# Altium schematic sheet 0112_AUDIO - AMP ALC131.SchDoc
size 848 x 558 mm
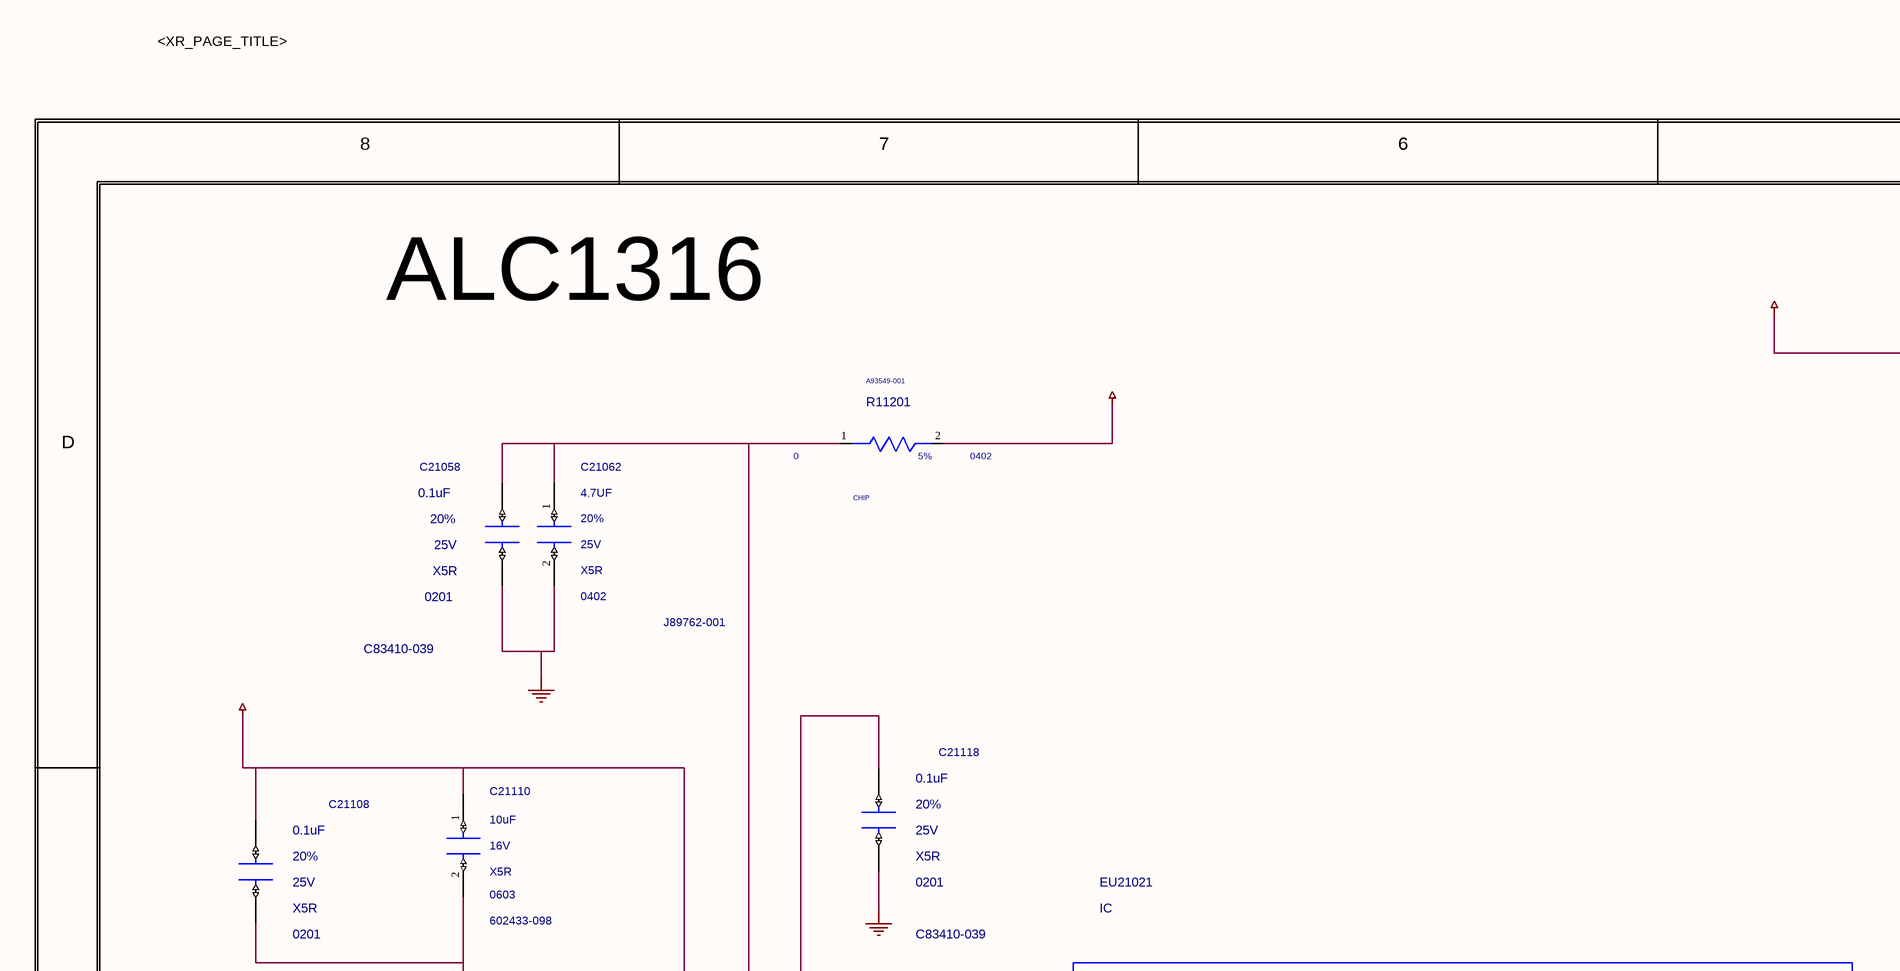
[diagram p0: 0112_AUDIO - AMP ALC131.SchDoc, top left]
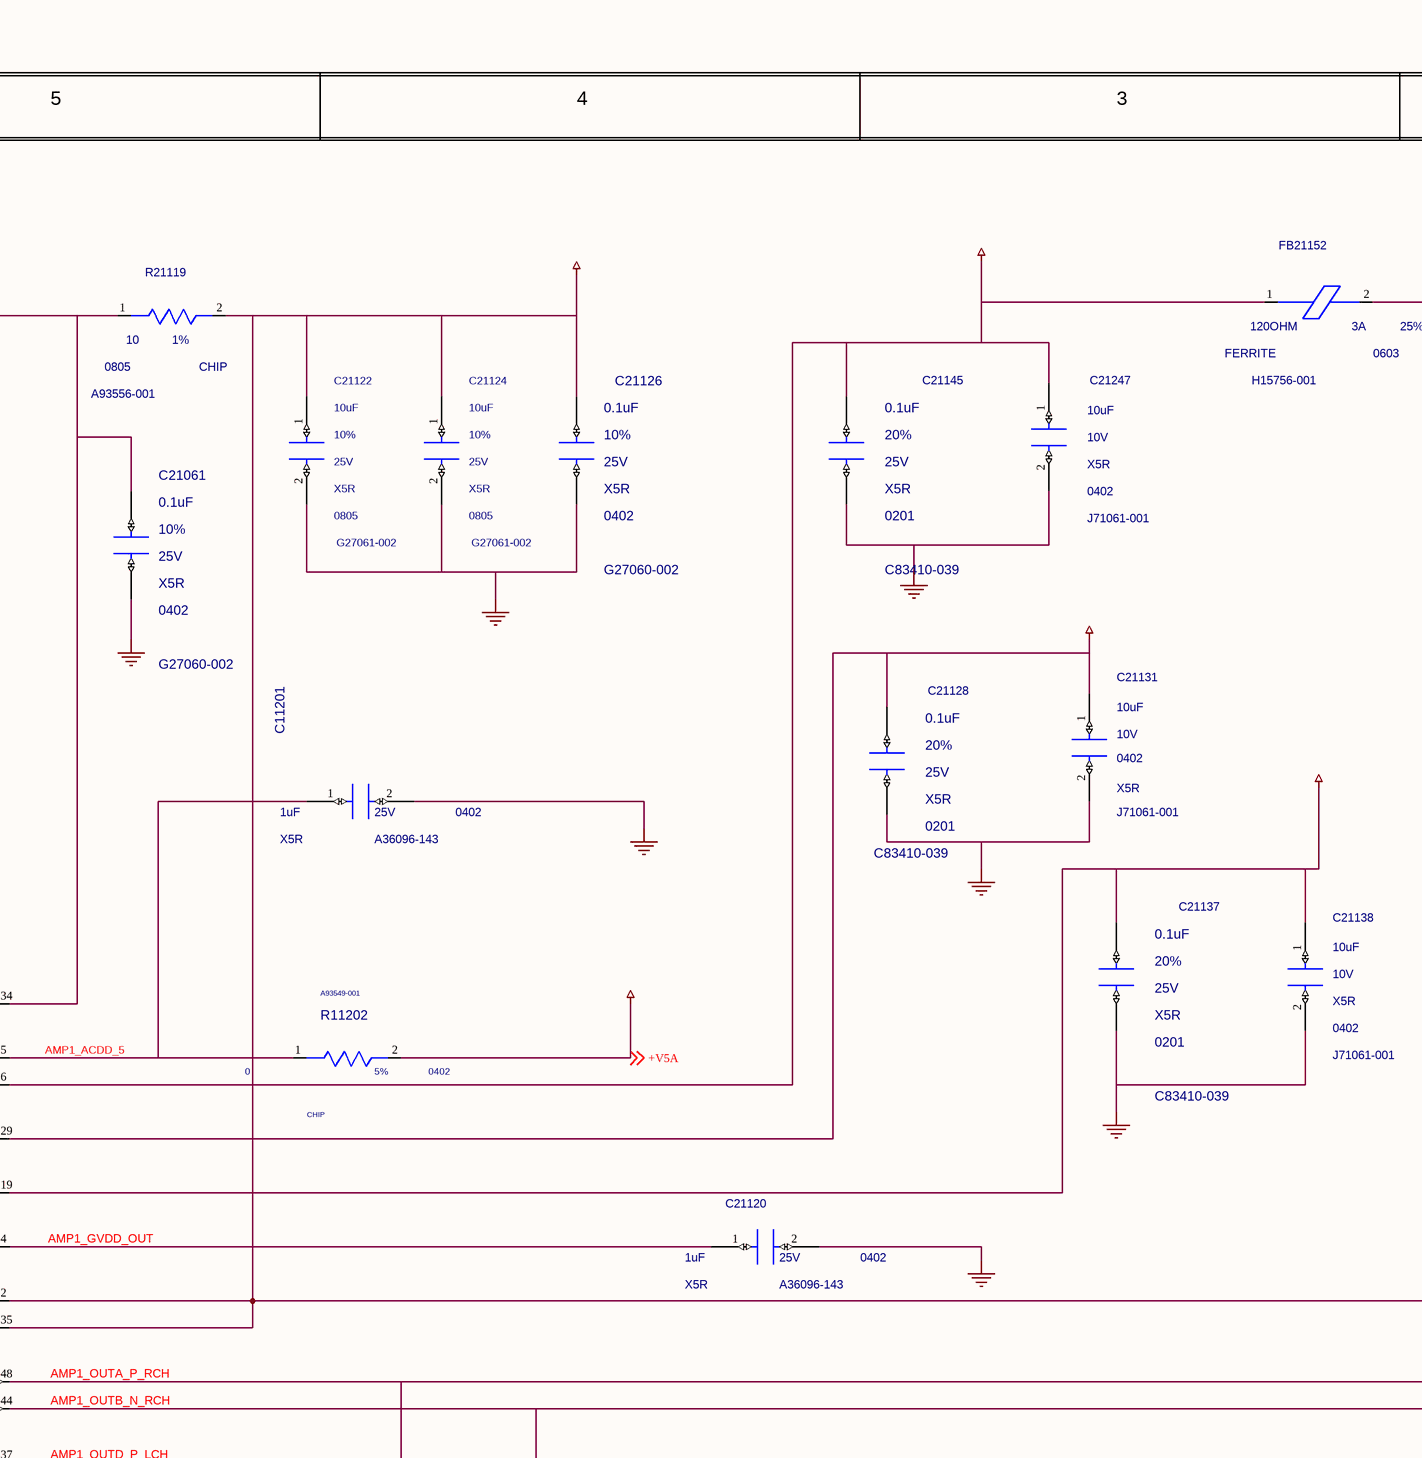
[diagram p1: 0112_AUDIO - AMP ALC131.SchDoc, top middle]
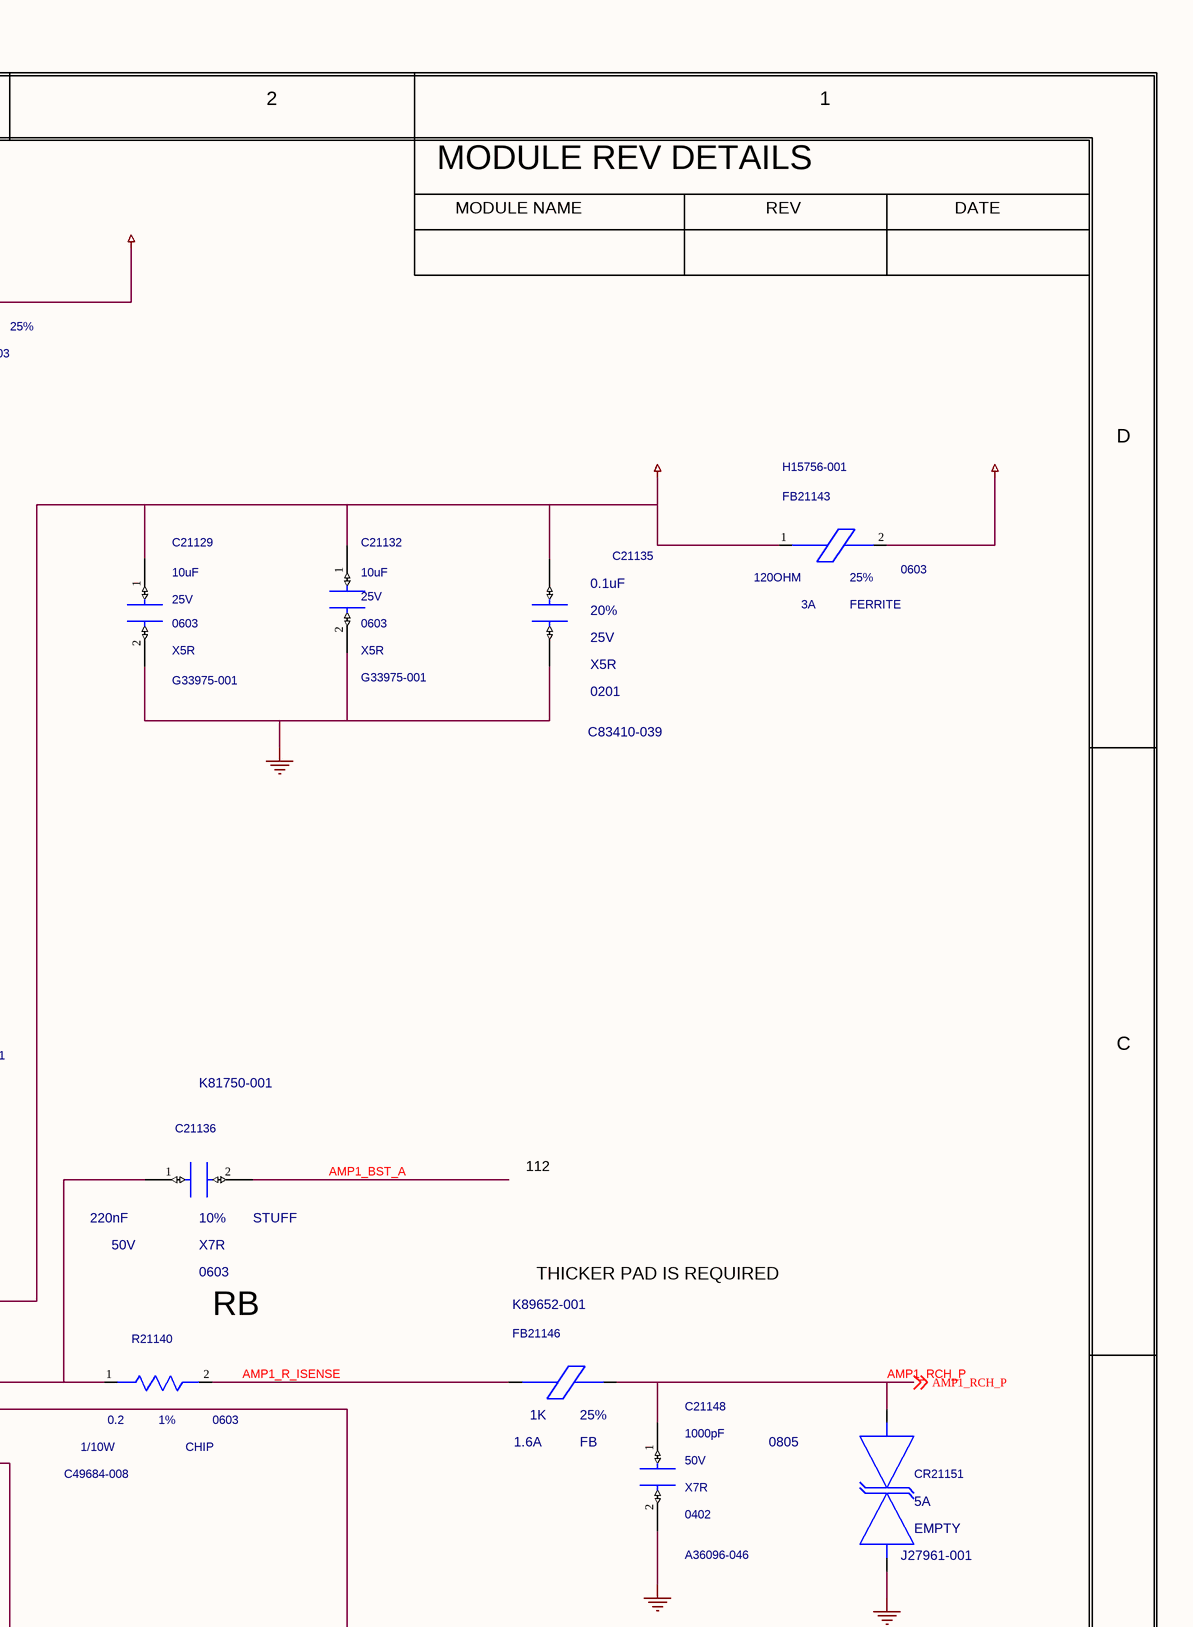
[diagram p2: 0112_AUDIO - AMP ALC131.SchDoc, top right]
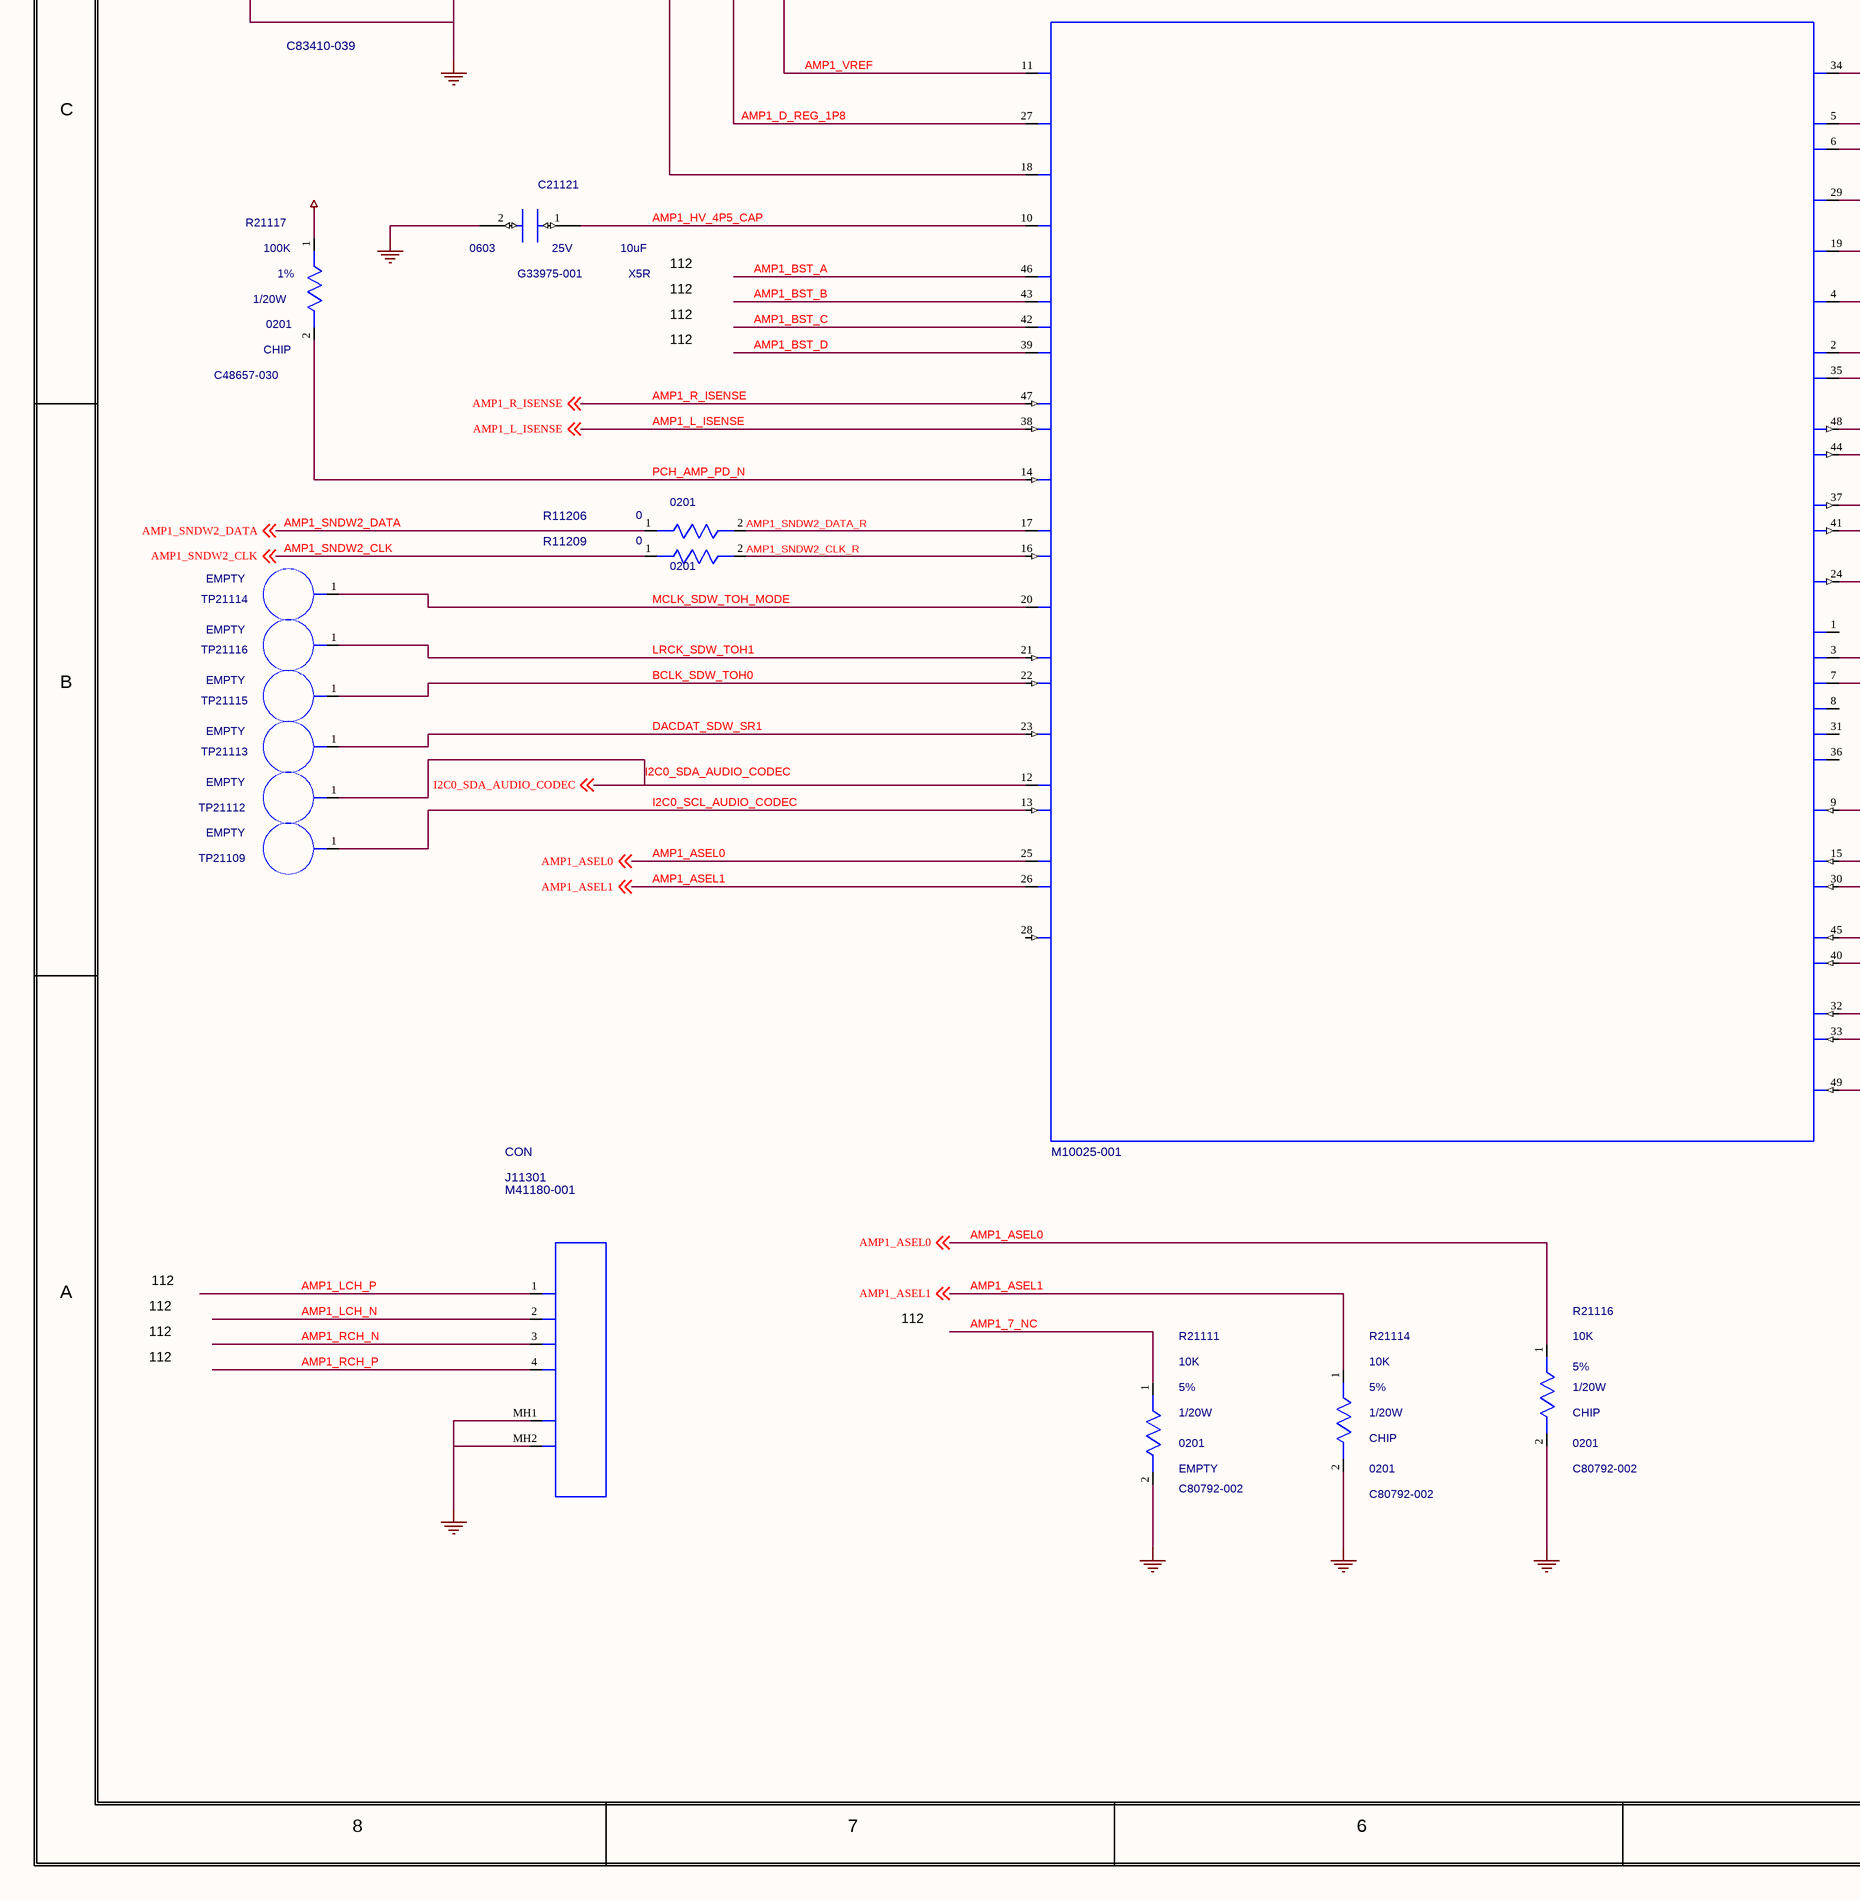
[diagram p3: 0112_AUDIO - AMP ALC131.SchDoc, bottom left]
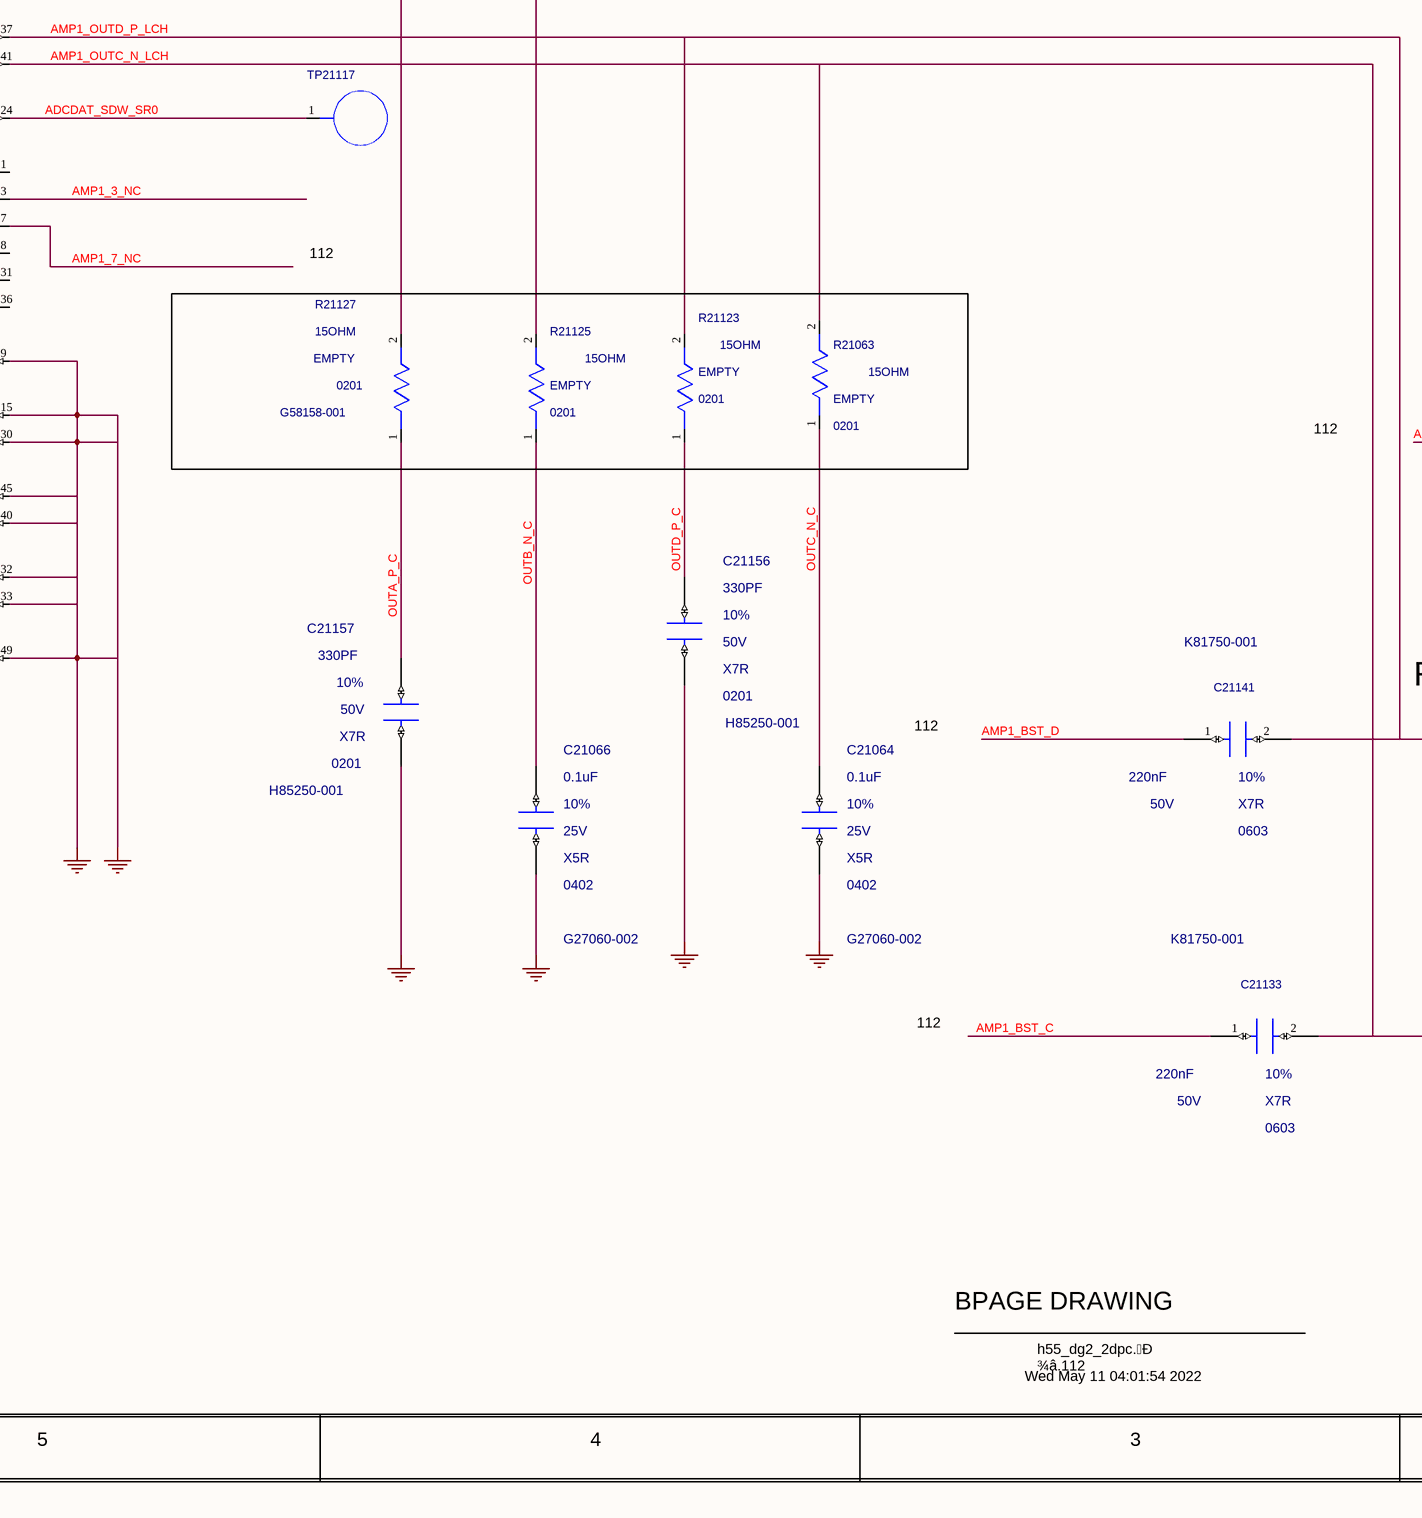
[diagram p4: 0112_AUDIO - AMP ALC131.SchDoc, bottom middle]
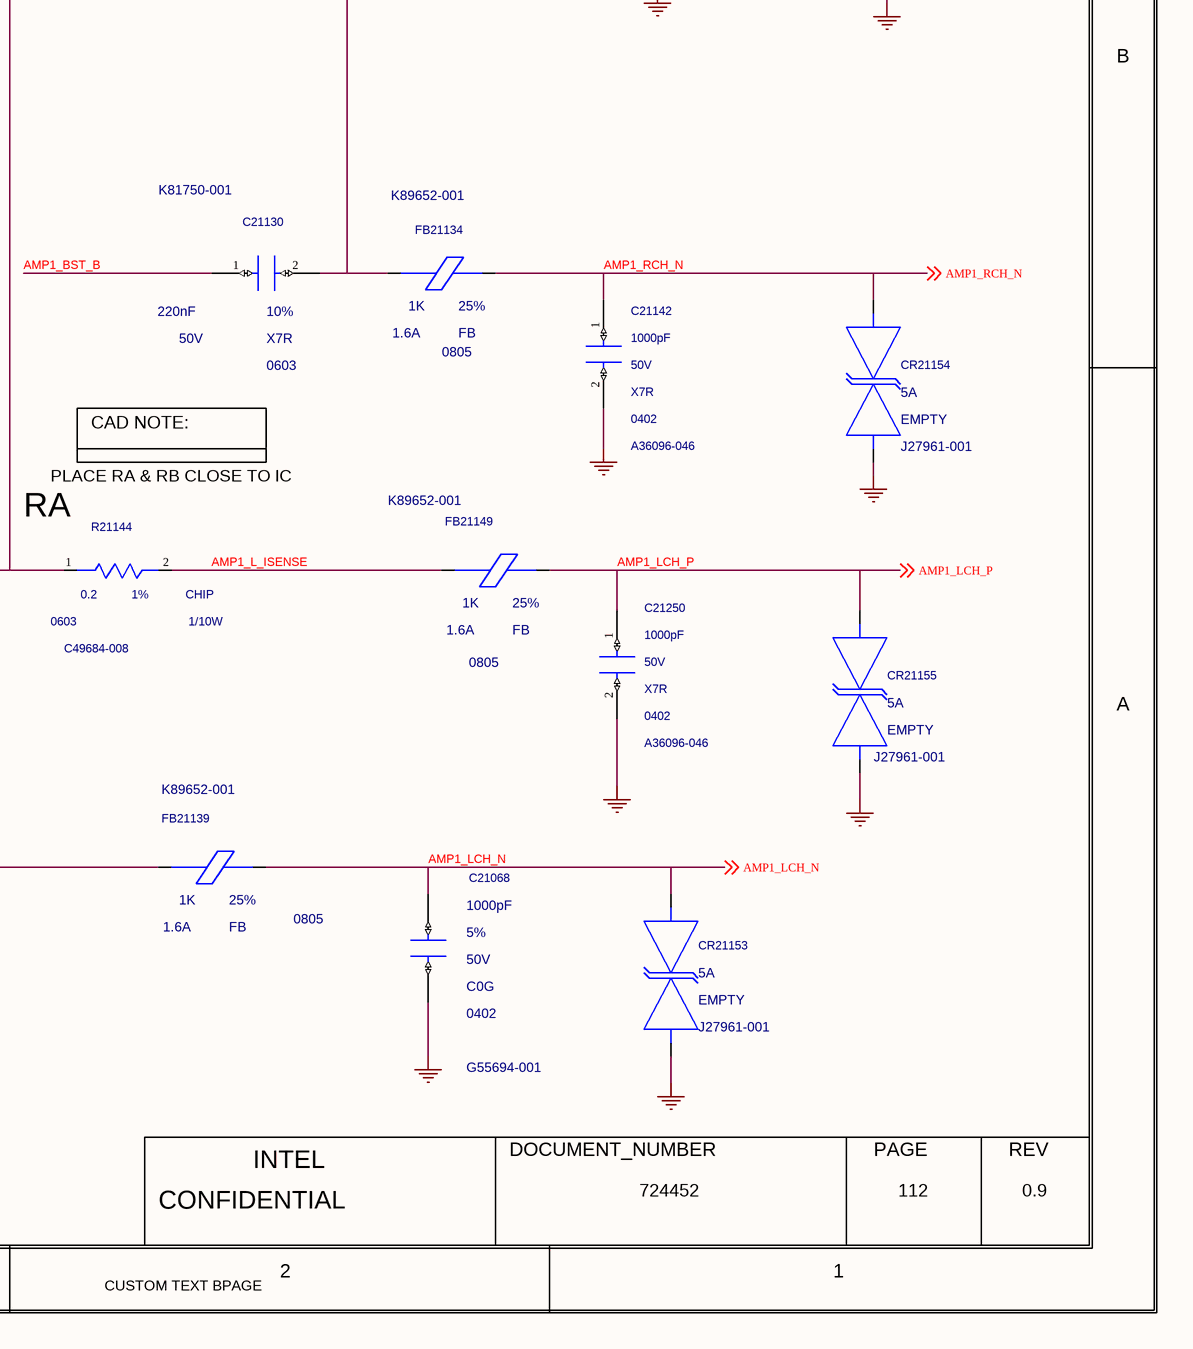
[diagram p5: 0112_AUDIO - AMP ALC131.SchDoc, bottom right]

## Parts
C11201  1uF  MATERIAL: X5R  PACK_TYPE: 0402  PART_NUMBER: A36096-143  VOLTAGE: 25V  [SMC0402MA]
C21058  0.1uF  MATERIAL: X5R  PACK_TYPE: 0201  PART_NUMBER: C83410-039  TOLERANCE: 20%  VOLTAGE: 25V  [TK0_SM0201_630X330_ME]
C21061  0.1uF  MATERIAL: X5R  PACK_TYPE: 0402  PART_NUMBER: G27060-002  TOLERANCE: 10%  VOLTAGE: 25V  [CTK2_SM0402_1050X550_MA]
C21062  4.7UF  MATERIAL: X5R  PACK_TYPE: 0402  PART_NUMBER: J89762-001  TOLERANCE: 20%  VOLTAGE: 25V  [SMC0402MC]
C21064  0.1uF  MATERIAL: X5R  PACK_TYPE: 0402  PART_NUMBER: G27060-002  TOLERANCE: 10%  VOLTAGE: 25V  [CTK2_SM0402_1050X550_MA]
C21066  0.1uF  MATERIAL: X5R  PACK_TYPE: 0402  PART_NUMBER: G27060-002  TOLERANCE: 10%  VOLTAGE: 25V  [CTK2_SM0402_1050X550_MA]
C21068  1000pF  MATERIAL: C0G  PACK_TYPE: 0402  PART_NUMBER: G55694-001  TOLERANCE: 5%  VOLTAGE: 50V  [TK0_SM0402_1050X550_MB]
C21108  0.1uF  MATERIAL: X5R  PACK_TYPE: 0201  PART_NUMBER: C83410-039  TOLERANCE: 20%  VOLTAGE: 25V  [TK0_SM0201_630X330_ME]
C21110  10uF  MATERIAL: X5R  PACK_TYPE: 0603  PART_NUMBER: 602433-098  VOLTAGE: 16V  [SMC0603IA]
C21118  0.1uF  MATERIAL: X5R  PACK_TYPE: 0201  PART_NUMBER: C83410-039  TOLERANCE: 20%  VOLTAGE: 25V  [TK0_SM0201_630X330_ME]
C21120  1uF  MATERIAL: X5R  PACK_TYPE: 0402  PART_NUMBER: A36096-143  VOLTAGE: 25V  [SMC0402MA]
C21121  10uF  MATERIAL: X5R  PACK_TYPE: 0603  PART_NUMBER: G33975-001  VOLTAGE: 25V  [SMC0603IA]
C21122  10uF  MATERIAL: X5R  PACK_TYPE: 0805  PART_NUMBER: G27061-002  TOLERANCE: 10%  VOLTAGE: 25V  [SMC0805MA]
C21124  10uF  MATERIAL: X5R  PACK_TYPE: 0805  PART_NUMBER: G27061-002  TOLERANCE: 10%  VOLTAGE: 25V  [SMC0805MA]
C21126  0.1uF  MATERIAL: X5R  PACK_TYPE: 0402  PART_NUMBER: G27060-002  TOLERANCE: 10%  VOLTAGE: 25V  [CTK2_SM0402_1050X550_MA]
C21128  0.1uF  MATERIAL: X5R  PACK_TYPE: 0201  PART_NUMBER: C83410-039  TOLERANCE: 20%  VOLTAGE: 25V  [TK0_SM0201_630X330_ME]
C21129  10uF  MATERIAL: X5R  PACK_TYPE: 0603  PART_NUMBER: G33975-001  VOLTAGE: 25V  [SMC0603IA]
C21130  220nF  MATERIAL: X7R  PACK_TYPE: 0603  PART_NUMBER: K81750-001  TOLERANCE: 10%  VOLTAGE: 50V  [TK0_SM0603_1800X950_MF]
C21131  10uF  MATERIAL: X5R  PACK_TYPE: 0402  PART_NUMBER: J71061-001  VOLTAGE: 10V  [SMC0402ID]
C21132  10uF  MATERIAL: X5R  PACK_TYPE: 0603  PART_NUMBER: G33975-001  VOLTAGE: 25V  [SMC0603IA]
C21133  220nF  MATERIAL: X7R  PACK_TYPE: 0603  PART_NUMBER: K81750-001  TOLERANCE: 10%  VOLTAGE: 50V  [TK0_SM0603_1800X950_MF]
C21135  0.1uF  MATERIAL: X5R  PACK_TYPE: 0201  PART_NUMBER: C83410-039  TOLERANCE: 20%  VOLTAGE: 25V  [TK0_SM0201_630X330_ME]
C21136  220nF  BOM_USE: STUFF  MATERIAL: X7R  PACK_TYPE: 0603  PART_NUMBER: K81750-001  TOLERANCE: 10%  VOLTAGE: 50V  [TK0_SM0603_1800X950_MF]
C21137  0.1uF  MATERIAL: X5R  PACK_TYPE: 0201  PART_NUMBER: C83410-039  TOLERANCE: 20%  VOLTAGE: 25V  [TK0_SM0201_630X330_ME]
C21138  10uF  MATERIAL: X5R  PACK_TYPE: 0402  PART_NUMBER: J71061-001  VOLTAGE: 10V  [SMC0402ID]
C21141  220nF  MATERIAL: X7R  PACK_TYPE: 0603  PART_NUMBER: K81750-001  TOLERANCE: 10%  VOLTAGE: 50V  [TK0_SM0603_1800X950_MF]
C21142  1000pF  MATERIAL: X7R  PACK_TYPE: 0402  PART_NUMBER: A36096-046  VOLTAGE: 50V  [SMC0402IA]
C21145  0.1uF  MATERIAL: X5R  PACK_TYPE: 0201  PART_NUMBER: C83410-039  TOLERANCE: 20%  VOLTAGE: 25V  [TK0_SM0201_630X330_ME]
C21148  1000pF  MATERIAL: X7R  PACK_TYPE: 0402  PART_NUMBER: A36096-046  VOLTAGE: 50V  [SMC0402IA]
C21156  330PF  MATERIAL: X7R  PACK_TYPE: 0201  PART_NUMBER: H85250-001  TOLERANCE: 10%  VOLTAGE: 50V  [CTK0_SM0201_630X330_MA]
C21157  330PF  MATERIAL: X7R  PACK_TYPE: 0201  PART_NUMBER: H85250-001  TOLERANCE: 10%  VOLTAGE: 50V  [CTK0_SM0201_630X330_MA]
C21247  10uF  MATERIAL: X5R  PACK_TYPE: 0402  PART_NUMBER: J71061-001  VOLTAGE: 10V  [SMC0402ID]
C21250  1000pF  MATERIAL: X7R  PACK_TYPE: 0402  PART_NUMBER: A36096-046  VOLTAGE: 50V  [SMC0402IA]
CR21151  CURRENT: 5A  MATERIAL: EMPTY  PART_NUMBER: J27961-001  [CTK2_SCR0201_670X370_MB]  (hidden comment: ESD203-B1-02ELS)
CR21153  CURRENT: 5A  MATERIAL: EMPTY  PART_NUMBER: J27961-001  [CTK2_SCR0201_670X370_MB]  (hidden comment: ESD203-B1-02ELS)
CR21154  CURRENT: 5A  MATERIAL: EMPTY  PART_NUMBER: J27961-001  [CTK2_SCR0201_670X370_MB]  (hidden comment: ESD203-B1-02ELS)
CR21155  CURRENT: 5A  MATERIAL: EMPTY  PART_NUMBER: J27961-001  [CTK2_SCR0201_670X370_MB]  (hidden comment: ESD203-B1-02ELS)
EU21021  MATERIAL: IC  PART_NUMBER: M10025-001  [CTK1_LCC48_S6100_400_DFS4400_MB]  (hidden comment: C_ALC1316)
FB21134  1K  CURRENT: 1.6A  MATERIAL: FB  PACK_TYPE: 0805  PART_NUMBER: K89652-001  TOLERANCE: 25%  [TK2_SM0805_2200X1450_MA]
FB21139  1K  CURRENT: 1.6A  MATERIAL: FB  PACK_TYPE: 0805  PART_NUMBER: K89652-001  TOLERANCE: 25%  [TK2_SM0805_2200X1450_MA]
FB21143  120OHM  CURRENT: 3A  PACK_TYPE: 0603  PART_NUMBER: H15756-001  TOLERANCE: 25%  [SFB0603IB]
FB21146  1K  CURRENT: 1.6A  MATERIAL: FB  PACK_TYPE: 0805  PART_NUMBER: K89652-001  TOLERANCE: 25%  [TK2_SM0805_2200X1450_MA]
FB21149  1K  CURRENT: 1.6A  MATERIAL: FB  PACK_TYPE: 0805  PART_NUMBER: K89652-001  TOLERANCE: 25%  [TK2_SM0805_2200X1450_MA]
FB21152  120OHM  CURRENT: 3A  PACK_TYPE: 0603  PART_NUMBER: H15756-001  TOLERANCE: 25%  [SFB0603IB]
J11301  MATERIAL: CON  PART_NUMBER: M41180-001  [CTK0_B2B_SPR_1X4_2EM_1000_MA_VR_KOZ]  (hidden comment: C_B2B_1X4_2EM)
R11201  0  MATERIAL: CHIP  PACK_TYPE: 0402  PART_NUMBER: A93549-001  TOLERANCE: 5%  [SMR0402IA]
R11202  0  MATERIAL: CHIP  PACK_TYPE: 0402  PART_NUMBER: A93549-001  TOLERANCE: 5%  [SMR0402IA]
R11206  0  PACK_TYPE: 0201  [SMR0201IA]
R11209  0  PACK_TYPE: 0201  [SMR0201IA]
R21063  15OHM  MATERIAL: EMPTY  PACK_TYPE: 0201  [SMR0201IA]
R21111  10K  MATERIAL: EMPTY  PACK_TYPE: 0201  PART_NUMBER: C80792-002  TOLERANCE: 5%  WATTAGE: 1/20W  [SMR0201IA]
R21114  10K  MATERIAL: CHIP  PACK_TYPE: 0201  PART_NUMBER: C80792-002  TOLERANCE: 5%  WATTAGE: 1/20W  [SMR0201IA]
R21116  10K  MATERIAL: CHIP  PACK_TYPE: 0201  PART_NUMBER: C80792-002  TOLERANCE: 5%  WATTAGE: 1/20W  [SMR0201IA]
R21117  100K  MATERIAL: CHIP  PACK_TYPE: 0201  PART_NUMBER: C48657-030  TOLERANCE: 1%  WATTAGE: 1/20W  [SMR0201MC]
R21119  10  MATERIAL: CHIP  PACK_TYPE: 0805  PART_NUMBER: A93556-001  TOLERANCE: 1%  [SMR0805IA]
R21123  15OHM  MATERIAL: EMPTY  PACK_TYPE: 0201  [SMR0201IA]
R21125  15OHM  MATERIAL: EMPTY  PACK_TYPE: 0201  [SMR0201IA]
R21127  15OHM  MATERIAL: EMPTY  PACK_TYPE: 0201  PART_NUMBER: G58158-001  [SMR0201IA]
R21140  0.2  MATERIAL: CHIP  PACK_TYPE: 0603  PART_NUMBER: C49684-008  TOLERANCE: 1%  WATTAGE: 1/10W  [SMR0603A]
R21144  0.2  MATERIAL: CHIP  PACK_TYPE: 0603  PART_NUMBER: C49684-008  TOLERANCE: 1%  WATTAGE: 1/10W  [SMR0603A]
TP21109  MATERIAL: EMPTY  [TPS16]  (hidden comment: TP)
TP21112  MATERIAL: EMPTY  [TPS16]  (hidden comment: TP)
TP21113  MATERIAL: EMPTY  [TPS16]  (hidden comment: TP)
TP21114  MATERIAL: EMPTY  [TPS16]  (hidden comment: TP)
TP21115  MATERIAL: EMPTY  [TPS16]  (hidden comment: TP)
TP21116  MATERIAL: EMPTY  [TPS16]  (hidden comment: TP)
TP21117  TP  [TPS16]  (value not drawn)

## Nets
+V1P8A_AUDIO: C21108.1(A) C21110.1(A) C21137.1(A) C21138.1(A) EU21021.18(SDW_IO_18) EU21021.19(DVDD_IO) R11201.2(B) R21117.1(A)
+V3P3DX_AUDIO: C21128.1(A) C21131.1(A) EU21021.29(DVDD_33) FB21152.2(B)
+V3P3DX_AUDIO_AMP1: C21145.1(A) C21247.1(A) EU21021.6(AVDD_33) FB21152.1(A)
+V5A: R11202.2(B) ; off-sheet +V5A
+VBATA_AMP1_AVCC: C21061.1(A) EU21021.34(AVCC) R21119.1(A)
+VBATA_AMP1_PVDD: C21122.1(A) C21124.1(A) C21126.1(A) C21129.1(A) C21132.1(A) C21135.1(A) EU21021.2(PVDD_AB) EU21021.35(PVDD_CD) FB21143.1(A) R21119.2(B)
+VBATA_SPK: FB21143.2(B)
GND: C11201.2(B) C21058.2(B) C21061.2(B) C21062.2(B) C21064.2(B) C21066.2(B) C21068.2(B) C21108.2(B) C21110.2(B) C21118.2(B) C21120.2(B) C21121.2(B) C21122.2(B) C21124.2(B) C21126.2(B) C21128.2(B) C21129.2(B) C21131.2(B) C21132.2(B) C21135.2(B) C21137.2(B) C21138.2(B) C21142.2(B) C21145.2(B) C21148.2(B) C21156.2(B) C21157.2(B) C21247.2(B) C21250.2(B) CR21151.2(A2) CR21153.2(A2) CR21154.2(A2) CR21155.2(A2) EU21021.9(AGND) EU21021.15(DGND) EU21021.30(DGND_LV) EU21021.32(VSS_SUB) EU21021.33(VSS_ANA) EU21021.40(PGND_CD) EU21021.45(PGND_AB) EU21021.49(GND_TPD) J11301.MH1 J11301.MH2 R21111.2(B) R21114.2(B) R21116.2(B)
ADCDAT_SDW_SR0: EU21021.24(ADCDAT_SDW_SR0) TP21117.1(TP)
AMP1_3_NC: EU21021.3(NC_2)
AMP1_7_NC: EU21021.7(NC_3) R21111.1(A)
AMP1_ACDD_5: C11201.1(A) EU21021.5(AVDD_5) R11202.1(A)
AMP1_ASEL0: EU21021.25(ASEL0_VI_DAT_SYNC) R21116.1(A) ; off-sheet AMP1_ASEL0
AMP1_ASEL1: EU21021.26(ASEL1) R21114.1(A) ; off-sheet AMP1_ASEL1
AMP1_BST_A: C21136.2(B) EU21021.46(BST_A)
AMP1_BST_B: C21130.1(A) EU21021.43(BST_B)
AMP1_BST_C: C21133.1(A) EU21021.42(BST_C)
AMP1_BST_D: C21141.1(A) EU21021.39(BST_D)
AMP1_D_REG_1P8: C21058.1(A) C21062.1(A) EU21021.27(D_REG_18) R11201.1(A)
AMP1_GVDD_OUT: C21120.1(A) EU21021.4(GVDD_OUT)
AMP1_HV_4P5_CAP: C21121.1(A) EU21021.10(HV_45_CAP)
AMP1_L_ISENSE: EU21021.38(L_ISENSE) FB21149.1(A) R21144.2(B) ; off-sheet AMP1_L_ISENSE
AMP1_LCH_N: C21068.1(A) CR21153.1(A1) FB21139.2(B) J11301.2(IO2) ; off-sheet AMP1_LCH_N
AMP1_LCH_P: C21250.1(A) CR21155.1(A1) FB21149.2(B) J11301.1(IO1) ; off-sheet AMP1_LCH_P
AMP1_OUTA_P_RCH: C21136.1(A) EU21021.48(OUTA_P_RCH) R21127.2(B) R21140.1(A)
AMP1_OUTB_N_RCH: C21130.2(B) EU21021.44(OUTB_N_RCH) FB21134.1(A) R21125.2(B)
AMP1_OUTC_N_LCH: C21133.2(B) EU21021.41(OUTC_N_LCH) FB21139.1(A) R21063.2(B)
AMP1_OUTD_P_LCH: C21141.2(B) EU21021.37(OUTD_P_LCH) R21123.2(B) R21144.1(A)
AMP1_R_ISENSE: EU21021.47(R_ISENSE) FB21146.1(A) R21140.2(B) ; off-sheet AMP1_R_ISENSE
AMP1_RCH_N: C21142.1(A) CR21154.1(A1) FB21134.2(B) J11301.3(IO3) ; off-sheet AMP1_RCH_N
AMP1_RCH_P: C21148.1(A) CR21151.1(A1) FB21146.2(B) J11301.4(IO4) ; off-sheet AMP1_RCH_P
AMP1_SNDW2_CLK: R11209.1(A) ; off-sheet AMP1_SNDW2_CLK
AMP1_SNDW2_CLK_R: EU21021.16(SDW_CLK) R11209.2(B)
AMP1_SNDW2_DATA: R11206.1(A) ; off-sheet AMP1_SNDW2_DATA
AMP1_SNDW2_DATA_R: EU21021.17(SDW_DAT) R11206.2(B)
AMP1_VREF: C21118.1(A) EU21021.11(VREF)
BCLK_SDW_TOH0: EU21021.22(BCLK_SDW_TOH0) TP21115.1(TP)
DACDAT_SDW_SR1: EU21021.23(DACDAT_SDW_SR1) TP21113.1(TP)
I2C0_SCL_AUDIO_CODEC: EU21021.13(SCL) TP21109.1(TP)
I2C0_SDA_AUDIO_CODEC: EU21021.12(SDA) TP21112.1(TP) ; off-sheet I2C0_SDA_AUDIO_CODEC
LRCK_SDW_TOH1: EU21021.21(LRCK_SDW_TOH1) TP21116.1(TP)
MCLK_SDW_TOH_MODE: EU21021.20(MCLK_SDW_TOH_MODE_VI_DAT_SYNC) TP21114.1(TP)
OUTA_P_C: C21157.1(A) R21127.1(A)
OUTB_N_C: C21066.1(A) R21125.1(A)
OUTC_N_C: C21064.1(A) R21063.1(A)
OUTD_P_C: C21156.1(A) R21123.1(A)
PCH_AMP_PD_N: EU21021.14(PDB) R21117.2(B)

Not connected (* = marked no-connect by the designer): EU21021 1(NC_1) 8(NC_4) 28(MULTI_SPK) 31(NC_5) 36(NC_6)

## Notes on the sheet
- <XR_PAGE_TITLE>
- 8
- 7
- 6
- 5
- 4
- 3
- 2
- 1
- MODULE REV DETAILS
- MODULE NAME
- REV
- DATE
- ALC1316
- D
- C
- 112
- THICKER PAD IS REQUIRED
- RB
- B
- CAD NOTE:
- PLACE RA & RB CLOSE TO IC
- (near R21144) RA
- A
- BPAGE DRAWING
- h55_dg2_2dpc.Ð
  ¾â.112
- INTEL
- DOCUMENT_NUMBER
- PAGE
- Wed May 11 04:01:54 2022
- CONFIDENTIAL
- 724452
- 0.9
- CUSTOM TEXT BPAGE

## Library data of the parts
C11201 = CAP: CDS_PHYS_PART_NAME: CAP_0402-A36096-143,X5R,1UF,25V,10%,LPDB,GENERIC; TOLERANCE: 10%; OriginalSymbolOrigin: (-50,25); XY: (4850,3725); VER: 1; PHYS_PAGE: 112; LOCATION: C11201; FP_TECH: LPDB; DRAWING: @RVP1_ADL_SB_ADP_S_DDR5_SODIMM_2DPC_LIB.H55_DG2_2DPC(SCH_1):PAGE483; CDS_LIB: discrete; PCB Footprint: SMC0402MA; ROT: 1; CHIPS_PART_NAME: CAP; CDS_PART_NAME: CAP_0402-A36096-143,X5R,1UF,25V,10%,LPDB,GENERIC; CDS_LOCATION: C11201
C21058 = CAP_2: CDS_PHYS_PART_NAME: CAP_2_0201-C83410-039,X5R,0.1UF,25V,20%,TK0,GENERIC; BOM_USE: STUFF; CDS_LMAN_SYM_OUTLINE: -50,50,50,-50; FP_TECH: TK0; IP: GENERIC; ROOM: NONE; OriginalSymbolOrigin: (-50,25); XY: (1550,4275); VER: 1; ROT: 2; PHYS_PAGE: 112; LOCATION: C21058; DRAWING: @RVP1_ADL_SB_ADP_S_DDR5_SODIMM_2DPC_LIB.H55_DG2_2DPC(SCH_1):PAGE483; CDS_LIB: discrete_2; VARIANT: ?; PCB Footprint: TK0_SM0201_630X330_ME; CHIPS_PART_NAME: CAP_2; CDS_PART_NAME: CAP_2_0201-C83410-039,X5R,0.1UF,25V,20%,TK0,GENERIC; CDS_LOCATION: C21058
C21061 = C_CAP: CDS_PHYS_PART_NAME: C_CAP_0402-G27060-002,X5R,0.1UF,25V,10%,TK2,GENERIC; CDS_LMAN_SYM_OUTLINE: -50,50,50,-50; FP_TECH: TK2; IP: GENERIC; ROOM: NONE; OriginalSymbolOrigin: (-50,25); XY: (4425,4200); VER: 1; ROT: 0; PHYS_PAGE: 112; LOCATION: C21061; DRAWING: @RVP1_ADL_SB_ADP_S_DDR5_SODIMM_2DPC_LIB.H55_DG2_2DPC(SCH_1):PAGE483; CDS_LIB: c_discrete; VARIANT: ?; PCB Footprint: CTK2_SM0402_1050X550_MA; CHIPS_PART_NAME: C_CAP; CDS_PART_NAME: C_CAP_0402-G27060-002,X5R,0.1UF,25V,10%,TK2,GENERIC; CDS_LOCATION: C21061
C21062 = CAP: CDS_PHYS_PART_NAME: CAP_0402-J89762-001,X5R,4.7UF,25V,20%,LPDB,GENERIC; OriginalSymbolOrigin: (-50,25); XY: (1650,4275); VER: 1; ROT: 2; ROOM: AUDIO; PHYS_PAGE: 112; LOCATION: C21062; IP: GENERIC; FP_TECH: LPDB; DRAWING: @RVP1_ADL_SB_ADP_S_DDR5_SODIMM_2DPC_LIB.H55_DG2_2DPC(SCH_1):PAGE483; CDS_LMAN_SYM_OUTLINE: -50,50,50,-50; CDS_LIB: discrete; BOM_USE: STUFF; PCB Footprint: SMC0402MC; CHIPS_PART_NAME: CAP; CDS_PART_NAME: CAP_0402-J89762-001,X5R,4.7UF,25V,20%,LPDB,GENERIC; CDS_LOCATION: C21062
C21064 = C_CAP: CDS_PHYS_PART_NAME: C_CAP_0402-G27060-002,X5R,0.1UF,25V,10%,TK2,GENERIC; CDS_LMAN_SYM_OUTLINE: -50,50,50,-50; FP_TECH: TK2; IP: GENERIC; ROOM: NONE; OriginalSymbolOrigin: (-50,25); XY: (5700,1050); VER: 1; ROT: 0; PHYS_PAGE: 112; LOCATION: C21064; DRAWING: @RVP1_ADL_SB_ADP_S_DDR5_SODIMM_2DPC_LIB.H55_DG2_2DPC(SCH_1):PAGE483; CDS_LIB: c_discrete; VARIANT: ?; PCB Footprint: CTK2_SM0402_1050X550_MA; CHIPS_PART_NAME: C_CAP; CDS_PART_NAME: C_CAP_0402-G27060-002,X5R,0.1UF,25V,10%,TK2,GENERIC; CDS_LOCATION: C21064
C21066 = C_CAP: CDS_PHYS_PART_NAME: C_CAP_0402-G27060-002,X5R,0.1UF,25V,10%,TK2,GENERIC; CDS_LMAN_SYM_OUTLINE: -50,50,50,-50; FP_TECH: TK2; IP: GENERIC; ROOM: NONE; OriginalSymbolOrigin: (-50,25); XY: (5175,1050); VER: 1; ROT: 0; PHYS_PAGE: 112; LOCATION: C21066; DRAWING: @RVP1_ADL_SB_ADP_S_DDR5_SODIMM_2DPC_LIB.H55_DG2_2DPC(SCH_1):PAGE483; CDS_LIB: c_discrete; VARIANT: ?; PCB Footprint: CTK2_SM0402_1050X550_MA; CHIPS_PART_NAME: C_CAP; CDS_PART_NAME: C_CAP_0402-G27060-002,X5R,0.1UF,25V,10%,TK2,GENERIC; CDS_LOCATION: C21066
C21068 = CAP_2: CDS_PHYS_PART_NAME: CAP_2_0402-G55694-001,C0G,1000PF,50V,5%,TK0,GENERIC; BOM_USE: STUFF; CDS_LMAN_SYM_OUTLINE: -50,50,50,-50; FP_TECH: TK0; IP: GENERIC; ROOM: NONE; OriginalSymbolOrigin: (-50,25); XY: (7550,500); VER: 1; SUB_ROOM: DECOUPLING; ROT: 0; PHYS_PAGE: 112; LOCATION: C21068; DRAWING: @RVP1_ADL_SB_ADP_S_DDR5_SODIMM_2DPC_LIB.H55_DG2_2DPC(SCH_1):PAGE483; CDS_LIB: discrete_2; VARIANT: ?; PCB Footprint: TK0_SM0402_1050X550_MB; SEC_TYPE: 0402; CHIPS_PART_NAME: CAP_2; CDS_PART_NAME: CAP_2_0402-G55694-001,C0G,1000PF,50V,5%,TK0,GENERIC; CDS_LOCATION: C21068
C21108 = CAP_2: CDS_PHYS_PART_NAME: CAP_2_0201-C83410-039,X5R,0.1UF,25V,20%,TK0,GENERIC; BOM_USE: STUFF; CDS_LMAN_SYM_OUTLINE: -50,50,50,-50; FP_TECH: TK0; IP: GENERIC; ROOM: NONE; OriginalSymbolOrigin: (-50,25); XY: (1075,3625); VER: 1; ROT: 0; PHYS_PAGE: 112; LOCATION: C21108; DRAWING: @RVP1_ADL_SB_ADP_S_DDR5_SODIMM_2DPC_LIB.H55_DG2_2DPC(SCH_1):PAGE483; CDS_LIB: discrete_2; VARIANT: ?; PCB Footprint: TK0_SM0201_630X330_ME; CHIPS_PART_NAME: CAP_2; CDS_PART_NAME: CAP_2_0201-C83410-039,X5R,0.1UF,25V,20%,TK0,GENERIC; CDS_LOCATION: C21108
C21110 = CAP: CDS_PHYS_PART_NAME: CAP_0603-602433-098,X5R,10UF,16V,20%,LPDB,GENERIC; TOLERANCE: 20%; OriginalSymbolOrigin: (-50,25); XY: (1475,3675); VER: 1; ROT: 0; ROOM: NONE; PHYS_PAGE: 112; LOCATION: C21110; IP: GENERIC; FP_TECH: LPDB; DRAWING: @RVP1_ADL_SB_ADP_S_DDR5_SODIMM_2DPC_LIB.H55_DG2_2DPC(SCH_1):PAGE483; CDS_LMAN_SYM_OUTLINE: -50,50,50,-50; CDS_LIB: discrete; BOM_USE: STUFF; PCB Footprint: SMC0603IA; CHIPS_PART_NAME: CAP; CDS_PART_NAME: CAP_0603-602433-098,X5R,10UF,16V,20%,LPDB,GENERIC; CDS_LOCATION: C21110
C21118 = CAP_2: CDS_PHYS_PART_NAME: CAP_2_0201-C83410-039,X5R,0.1UF,25V,20%,TK0,GENERIC; BOM_USE: STUFF; CDS_LMAN_SYM_OUTLINE: -50,50,50,-50; FP_TECH: TK0; IP: GENERIC; ROOM: NONE; OriginalSymbolOrigin: (-50,25); XY: (2275,3725); VER: 1; ROT: 0; PHYS_PAGE: 112; LOCATION: C21118; DRAWING: @RVP1_ADL_SB_ADP_S_DDR5_SODIMM_2DPC_LIB.H55_DG2_2DPC(SCH_1):PAGE483; CDS_LIB: discrete_2; VARIANT: ?; PCB Footprint: TK0_SM0201_630X330_ME; CHIPS_PART_NAME: CAP_2; CDS_PART_NAME: CAP_2_0201-C83410-039,X5R,0.1UF,25V,20%,TK0,GENERIC; CDS_LOCATION: C21118
C21120 = CAP: CDS_PHYS_PART_NAME: CAP_0402-A36096-143,X5R,1UF,25V,10%,LPDB,GENERIC; TOLERANCE: 10%; OriginalSymbolOrigin: (-50,25); XY: (5600,2900); VER: 1; PHYS_PAGE: 112; LOCATION: C21120; FP_TECH: LPDB; DRAWING: @RVP1_ADL_SB_ADP_S_DDR5_SODIMM_2DPC_LIB.H55_DG2_2DPC(SCH_1):PAGE483; CDS_LIB: discrete; PCB Footprint: SMC0402MA; ROT: 1; CHIPS_PART_NAME: CAP; CDS_PART_NAME: CAP_0402-A36096-143,X5R,1UF,25V,10%,LPDB,GENERIC; CDS_LOCATION: C21120
C21121 = CAP: CDS_PHYS_PART_NAME: CAP_0603-G33975-001,X5R,10UF,25V,20%,LPDB,GENERIC; TOLERANCE: 20%; OriginalSymbolOrigin: (-50,25); XY: (1625,3050); VER: 1; ROT: 7; ROOM: NONE; PHYS_PAGE: 112; LOCATION: C21121; IP: GENERIC; FP_TECH: LPDB; DRAWING: @RVP1_ADL_SB_ADP_S_DDR5_SODIMM_2DPC_LIB.H55_DG2_2DPC(SCH_1):PAGE483; CDS_LMAN_SYM_OUTLINE: -50,50,50,-50; CDS_LIB: discrete; BOM_USE: STUFF; PCB Footprint: SMC0603IA; SEC_TYPE: 0603; CHIPS_PART_NAME: CAP; CDS_PART_NAME: CAP_0603-G33975-001,X5R,10UF,25V,20%,LPDB,GENERIC; CDS_LOCATION: C21121
C21122 = CAP: CDS_PHYS_PART_NAME: CAP_0805-G27061-002,X5R,10UF,25V,10%,LPDB,GENERIC; OriginalSymbolOrigin: (-50,25); XY: (4750,4375); VER: 1; ROT: 0; PHYS_PAGE: 112; LOCATION: C21122; DRAWING: @RVP1_ADL_SB_ADP_S_DDR5_SODIMM_2DPC_LIB.H55_DG2_2DPC(SCH_1):PAGE483; CDS_LIB: discrete; PCB Footprint: SMC0805MA; CHIPS_PART_NAME: CAP; CDS_PART_NAME: CAP_0805-G27061-002,X5R,10UF,25V,10%,LPDB,GENERIC; CDS_LOCATION: C21122
C21124 = CAP: CDS_PHYS_PART_NAME: CAP_0805-G27061-002,X5R,10UF,25V,10%,LPDB,GENERIC; OriginalSymbolOrigin: (-50,25); XY: (5000,4375); VER: 1; ROT: 0; PHYS_PAGE: 112; LOCATION: C21124; DRAWING: @RVP1_ADL_SB_ADP_S_DDR5_SODIMM_2DPC_LIB.H55_DG2_2DPC(SCH_1):PAGE483; CDS_LIB: discrete; PCB Footprint: SMC0805MA; CHIPS_PART_NAME: CAP; CDS_PART_NAME: CAP_0805-G27061-002,X5R,10UF,25V,10%,LPDB,GENERIC; CDS_LOCATION: C21124
C21126 = C_CAP: CDS_PHYS_PART_NAME: C_CAP_0402-G27060-002,X5R,0.1UF,25V,10%,TK2,GENERIC; CDS_LMAN_SYM_OUTLINE: -50,50,50,-50; FP_TECH: TK2; IP: GENERIC; ROOM: NONE; OriginalSymbolOrigin: (-50,25); XY: (5250,4375); VER: 1; ROT: 0; PHYS_PAGE: 112; LOCATION: C21126; DRAWING: @RVP1_ADL_SB_ADP_S_DDR5_SODIMM_2DPC_LIB.H55_DG2_2DPC(SCH_1):PAGE483; CDS_LIB: c_discrete; VARIANT: ?; PCB Footprint: CTK2_SM0402_1050X550_MA; CHIPS_PART_NAME: C_CAP; CDS_PART_NAME: C_CAP_0402-G27060-002,X5R,0.1UF,25V,10%,TK2,GENERIC; CDS_LOCATION: C21126
C21128 = CAP_2: CDS_PHYS_PART_NAME: CAP_2_0201-C83410-039,X5R,0.1UF,25V,20%,TK0,GENERIC; BOM_USE: STUFF; CDS_LMAN_SYM_OUTLINE: -50,50,50,-50; FP_TECH: TK0; IP: GENERIC; ROOM: NONE; OriginalSymbolOrigin: (-50,25); XY: (5825,3800); VER: 1; ROT: 0; PHYS_PAGE: 112; LOCATION: C21128; DRAWING: @RVP1_ADL_SB_ADP_S_DDR5_SODIMM_2DPC_LIB.H55_DG2_2DPC(SCH_1):PAGE483; CDS_LIB: discrete_2; VARIANT: ?; PCB Footprint: TK0_SM0201_630X330_ME; CHIPS_PART_NAME: CAP_2; CDS_PART_NAME: CAP_2_0201-C83410-039,X5R,0.1UF,25V,20%,TK0,GENERIC; CDS_LOCATION: C21128
C21129 = CAP: CDS_PHYS_PART_NAME: CAP_0603-G33975-001,X5R,10UF,25V,20%,LPDB,GENERIC; TOLERANCE: 20%; OriginalSymbolOrigin: (-50,25); XY: (7025,4075); VER: 1; ROT: 0; PHYS_PAGE: 112; LOCATION: C21129; FP_TECH: LPDB; DRAWING: @RVP1_ADL_SB_ADP_S_DDR5_SODIMM_2DPC_LIB.H55_DG2_2DPC(SCH_1):PAGE483; CDS_LIB: discrete; PCB Footprint: SMC0603IA; CHIPS_PART_NAME: CAP; CDS_PART_NAME: CAP_0603-G33975-001,X5R,10UF,25V,20%,LPDB,GENERIC; CDS_LOCATION: C21129
C21130 = CAP_2#1: CHIPS_PART_NAME: CAP_2; CDS_PHYS_PART_NAME: CAP_2_0603-K81750-001,X7R,220NF,50V,10%,TK0,GENERIC; BOM_USE: STUFF; CDS_LMAN_SYM_OUTLINE: -50,50,50,-50; FP_TECH: TK0; IP: GENERIC; ROOM: NONE; OriginalSymbolOrigin: (-25,50); XY: (7250,1750); VER: 2; ROT: 0; PHYS_PAGE: 112; LOCATION: C21130; DRAWING: @RVP1_ADL_SB_ADP_S_DDR5_SODIMM_2DPC_LIB.H55_DG2_2DPC(SCH_1):PAGE483; CDS_LIB: discrete_2; VARIANT: ?; PCB Footprint: TK0_SM0603_1800X950_MF; CDS_PART_NAME: CAP_2_0603-K81750-001,X7R,220NF,50V,10%,TK0,GENERIC; CDS_LOCATION: C21130
C21131 = CAP: CDS_PHYS_PART_NAME: CAP_0402-J71061-001,X5R,10UF,10V,20%,LPDB,GENERIC; TOLERANCE: 20%; OriginalSymbolOrigin: (-50,25); XY: (6200,3825); VER: 1; ROT: 0; PHYS_PAGE: 112; LOCATION: C21131; FP_TECH: LPDB; DRAWING: @RVP1_ADL_SB_ADP_S_DDR5_SODIMM_2DPC_LIB.H55_DG2_2DPC(SCH_1):PAGE483; CDS_LIB: discrete; PCB Footprint: SMC0402ID; CHIPS_PART_NAME: CAP; CDS_PART_NAME: CAP_0402-J71061-001,X5R,10UF,10V,20%,LPDB,GENERIC; CDS_LOCATION: C21131
C21132 = CAP: CDS_PHYS_PART_NAME: CAP_0603-G33975-001,X5R,10UF,25V,20%,LPDB,GENERIC; TOLERANCE: 20%; OriginalSymbolOrigin: (-50,25); XY: (7400,4100); VER: 1; ROT: 0; PHYS_PAGE: 112; LOCATION: C21132; FP_TECH: LPDB; DRAWING: @RVP1_ADL_SB_ADP_S_DDR5_SODIMM_2DPC_LIB.H55_DG2_2DPC(SCH_1):PAGE483; CDS_LIB: discrete; PCB Footprint: SMC0603IA; CHIPS_PART_NAME: CAP; CDS_PART_NAME: CAP_0603-G33975-001,X5R,10UF,25V,20%,LPDB,GENERIC; CDS_LOCATION: C21132
C21133 = CAP_2#1: CHIPS_PART_NAME: CAP_2; CDS_PHYS_PART_NAME: CAP_2_0603-K81750-001,X7R,220NF,50V,10%,TK0,GENERIC; BOM_USE: STUFF; CDS_LMAN_SYM_OUTLINE: -50,50,50,-50; FP_TECH: TK0; IP: GENERIC; ROOM: NONE; OriginalSymbolOrigin: (-25,50); XY: (6525,650); WATTAGE: 1/20W; VER: 2; SUB_ROOM: TERMINATION; ROT: 0; PHYS_PAGE: 112; LOCATION: C21133; DRAWING: @RVP1_ADL_SB_ADP_S_DDR5_SODIMM_2DPC_LIB.H55_DG2_2DPC(SCH_1):PAGE483; CDS_LIB: discrete_2; VARIANT: ?; PCB Footprint: TK0_SM0603_1800X950_MF; CDS_PART_NAME: CAP_2_0603-K81750-001,X7R,220NF,50V,10%,TK0,GENERIC; CDS_LOCATION: C21133
C21135 = CAP_2: CDS_PHYS_PART_NAME: CAP_2_0201-C83410-039,X5R,0.1UF,25V,20%,TK0,GENERIC; BOM_USE: STUFF; CDS_LMAN_SYM_OUTLINE: -50,50,50,-50; FP_TECH: TK0; IP: GENERIC; ROOM: NONE; OriginalSymbolOrigin: (-50,25); XY: (7775,4075); VER: 1; ROT: 0; PHYS_PAGE: 112; LOCATION: C21135; DRAWING: @RVP1_ADL_SB_ADP_S_DDR5_SODIMM_2DPC_LIB.H55_DG2_2DPC(SCH_1):PAGE483; CDS_LIB: discrete_2; VARIANT: ?; PCB Footprint: TK0_SM0201_630X330_ME; CHIPS_PART_NAME: CAP_2; CDS_PART_NAME: CAP_2_0201-C83410-039,X5R,0.1UF,25V,20%,TK0,GENERIC; CDS_LOCATION: C21135
C21136 = CAP_2#1: CHIPS_PART_NAME: CAP_2; CDS_PHYS_PART_NAME: CAP_2_0603-K81750-001,X7R,220NF,50V,10%,TK0,GENERIC; CDS_LMAN_SYM_OUTLINE: -50,50,50,-50; FP_TECH: TK0; IP: GENERIC; ROOM: NONE; OriginalSymbolOrigin: (-25,50); XY: (7125,3025); WATTAGE: 1/20W; VER: 2; SUB_ROOM: TERMINATION; ROT: 0; PHYS_PAGE: 112; LOCATION: C21136; DRAWING: @RVP1_ADL_SB_ADP_S_DDR5_SODIMM_2DPC_LIB.H55_DG2_2DPC(SCH_1):PAGE483; CDS_LIB: discrete_2; VARIANT: ?; PCB Footprint: TK0_SM0603_1800X950_MF; CDS_PART_NAME: CAP_2_0603-K81750-001,X7R,220NF,50V,10%,TK0,GENERIC; CDS_LOCATION: C21136
C21137 = CAP_2: CDS_PHYS_PART_NAME: CAP_2_0201-C83410-039,X5R,0.1UF,25V,20%,TK0,GENERIC; BOM_USE: STUFF; CDS_LMAN_SYM_OUTLINE: -50,50,50,-50; FP_TECH: TK0; IP: GENERIC; ROOM: NONE; OriginalSymbolOrigin: (-50,25); XY: (6250,3400); VER: 1; ROT: 0; PHYS_PAGE: 112; LOCATION: C21137; DRAWING: @RVP1_ADL_SB_ADP_S_DDR5_SODIMM_2DPC_LIB.H55_DG2_2DPC(SCH_1):PAGE483; CDS_LIB: discrete_2; VARIANT: ?; PCB Footprint: TK0_SM0201_630X330_ME; CHIPS_PART_NAME: CAP_2; CDS_PART_NAME: CAP_2_0201-C83410-039,X5R,0.1UF,25V,20%,TK0,GENERIC; CDS_LOCATION: C21137
C21138 = CAP: CDS_PHYS_PART_NAME: CAP_0402-J71061-001,X5R,10UF,10V,20%,LPDB,GENERIC; TOLERANCE: 20%; OriginalSymbolOrigin: (-50,25); XY: (6600,3400); VER: 1; ROT: 0; PHYS_PAGE: 112; LOCATION: C21138; FP_TECH: LPDB; DRAWING: @RVP1_ADL_SB_ADP_S_DDR5_SODIMM_2DPC_LIB.H55_DG2_2DPC(SCH_1):PAGE483; CDS_LIB: discrete; PCB Footprint: SMC0402ID; CHIPS_PART_NAME: CAP; CDS_PART_NAME: CAP_0402-J71061-001,X5R,10UF,10V,20%,LPDB,GENERIC; CDS_LOCATION: C21138
C21141 = CAP_2#1: CHIPS_PART_NAME: CAP_2; CDS_PHYS_PART_NAME: CAP_2_0603-K81750-001,X7R,220NF,50V,10%,TK0,GENERIC; BOM_USE: STUFF; CDS_LMAN_SYM_OUTLINE: -50,50,50,-50; FP_TECH: TK0; IP: GENERIC; ROOM: NONE; OriginalSymbolOrigin: (-25,50); XY: (6475,1200); VER: 2; ROT: 0; PHYS_PAGE: 112; LOCATION: C21141; DRAWING: @RVP1_ADL_SB_ADP_S_DDR5_SODIMM_2DPC_LIB.H55_DG2_2DPC(SCH_1):PAGE483; CDS_LIB: discrete_2; VARIANT: ?; PCB Footprint: TK0_SM0603_1800X950_MF; CDS_PART_NAME: CAP_2_0603-K81750-001,X7R,220NF,50V,10%,TK0,GENERIC; CDS_LOCATION: C21141
C21142 = CAP: CDS_PHYS_PART_NAME: CAP_0402-A36096-046,X7R,1000PF,50V,10%,LPDB,GENERIC; TOLERANCE: 10%; OriginalSymbolOrigin: (-50,25); XY: (7875,1600); VER: 1; ROT: 0; PHYS_PAGE: 112; LOCATION: C21142; FP_TECH: LPDB; DRAWING: @RVP1_ADL_SB_ADP_S_DDR5_SODIMM_2DPC_LIB.H55_DG2_2DPC(SCH_1):PAGE483; CDS_LIB: discrete; PCB Footprint: SMC0402IA; SEC_TYPE: 0402; CHIPS_PART_NAME: CAP; CDS_PART_NAME: CAP_0402-A36096-046,X7R,1000PF,50V,10%,LPDB,GENERIC; CDS_LOCATION: C21142
C21145 = CAP_2: CDS_PHYS_PART_NAME: CAP_2_0201-C83410-039,X5R,0.1UF,25V,20%,TK0,GENERIC; BOM_USE: STUFF; CDS_LMAN_SYM_OUTLINE: -50,50,50,-50; FP_TECH: TK0; IP: GENERIC; ROOM: NONE; OriginalSymbolOrigin: (-50,25); XY: (5750,4375); VER: 1; ROT: 0; PHYS_PAGE: 112; LOCATION: C21145; DRAWING: @RVP1_ADL_SB_ADP_S_DDR5_SODIMM_2DPC_LIB.H55_DG2_2DPC(SCH_1):PAGE483; CDS_LIB: discrete_2; VARIANT: ?; PCB Footprint: TK0_SM0201_630X330_ME; CHIPS_PART_NAME: CAP_2; CDS_PART_NAME: CAP_2_0201-C83410-039,X5R,0.1UF,25V,20%,TK0,GENERIC; CDS_LOCATION: C21145
C21148 = CAP: CDS_PHYS_PART_NAME: CAP_0402-A36096-046,X7R,1000PF,50V,10%,LPDB,GENERIC; TOLERANCE: 10%; OriginalSymbolOrigin: (-50,25); XY: (7975,2475); VER: 1; ROT: 0; PHYS_PAGE: 112; LOCATION: C21148; FP_TECH: LPDB; DRAWING: @RVP1_ADL_SB_ADP_S_DDR5_SODIMM_2DPC_LIB.H55_DG2_2DPC(SCH_1):PAGE483; CDS_LIB: discrete; PCB Footprint: SMC0402IA; SEC_TYPE: 0402; CHIPS_PART_NAME: CAP; CDS_PART_NAME: CAP_0402-A36096-046,X7R,1000PF,50V,10%,LPDB,GENERIC; CDS_LOCATION: C21148
C21156 = C_CAP: CDS_PHYS_PART_NAME: C_CAP_0201-H85250-001,X7R,330PF,50V,10%,TK0,GENERIC; CDS_LMAN_SYM_OUTLINE: -50,50,50,-50; FP_TECH: TK0; IP: GENERIC; ROOM: NONE; OriginalSymbolOrigin: (-50,25); XY: (5450,1400); VER: 1; ROT: 0; PHYS_PAGE: 112; LOCATION: C21156; DRAWING: @RVP1_ADL_SB_ADP_S_DDR5_SODIMM_2DPC_LIB.H55_DG2_2DPC(SCH_1):PAGE483; CDS_LIB: c_discrete; VARIANT: ?; PCB Footprint: CTK0_SM0201_630X330_MA; SEC_TYPE: 0201; CHIPS_PART_NAME: C_CAP; CDS_PART_NAME: C_CAP_0201-H85250-001,X7R,330PF,50V,10%,TK0,GENERIC; CDS_LOCATION: C21156
C21157 = C_CAP: CDS_PHYS_PART_NAME: C_CAP_0201-H85250-001,X7R,330PF,50V,10%,TK0,GENERIC; CDS_LMAN_SYM_OUTLINE: -50,50,50,-50; FP_TECH: TK0; IP: GENERIC; ROOM: NONE; OriginalSymbolOrigin: (-50,25); XY: (4925,1250); VER: 1; ROT: 0; PHYS_PAGE: 112; LOCATION: C21157; DRAWING: @RVP1_ADL_SB_ADP_S_DDR5_SODIMM_2DPC_LIB.H55_DG2_2DPC(SCH_1):PAGE483; CDS_LIB: c_discrete; VARIANT: ?; PCB Footprint: CTK0_SM0201_630X330_MA; SEC_TYPE: 0201; CHIPS_PART_NAME: C_CAP; CDS_PART_NAME: C_CAP_0201-H85250-001,X7R,330PF,50V,10%,TK0,GENERIC; CDS_LOCATION: C21157
C21247 = CAP: CDS_PHYS_PART_NAME: CAP_0402-J71061-001,X5R,10UF,10V,20%,LPDB,GENERIC; TOLERANCE: 20%; OriginalSymbolOrigin: (-50,25); XY: (6125,4400); VER: 1; ROT: 0; PHYS_PAGE: 112; LOCATION: C21247; FP_TECH: LPDB; DRAWING: @RVP1_ADL_SB_ADP_S_DDR5_SODIMM_2DPC_LIB.H55_DG2_2DPC(SCH_1):PAGE483; CDS_LIB: discrete; PCB Footprint: SMC0402ID; CHIPS_PART_NAME: CAP; CDS_PART_NAME: CAP_0402-J71061-001,X5R,10UF,10V,20%,LPDB,GENERIC; CDS_LOCATION: C21247
C21250 = CAP: CDS_PHYS_PART_NAME: CAP_0402-A36096-046,X7R,1000PF,50V,10%,LPDB,GENERIC; TOLERANCE: 10%; OriginalSymbolOrigin: (-50,25); XY: (7900,1025); VER: 1; ROT: 0; PHYS_PAGE: 112; LOCATION: C21250; FP_TECH: LPDB; DRAWING: @RVP1_ADL_SB_ADP_S_DDR5_SODIMM_2DPC_LIB.H55_DG2_2DPC(SCH_1):PAGE483; CDS_LIB: discrete; PCB Footprint: SMC0402IA; SEC_TYPE: 0402; CHIPS_PART_NAME: CAP; CDS_PART_NAME: CAP_0402-A36096-046,X7R,1000PF,50V,10%,LPDB,GENERIC; CDS_LOCATION: C21250
CR21151 = C_DIODE_TVS: CDS_PHYS_PART_NAME: C_DIODE_TVS_SM-J27961-001,EMPTY,ESD203-B1-02ELS,5A,TK2,GENERIC; CDS_LMAN_SYM_OUTLINE: -100,50,100,-50; FP_TECH: TK2; IP: GENERIC; PACK_TYPE: SM; ROOM: NONE; OriginalSymbolOrigin: (-125,50); XY: (8400,2450); VER: 1; ROT: 3; PHYS_PAGE: 112; LOCATION: CR21151; DRAWING: @RVP1_ADL_SB_ADP_S_DDR5_SODIMM_2DPC_LIB.H55_DG2_2DPC(SCH_1):PAGE483; CDS_LIB: local; VARIANT: ?; PCB Footprint: CTK2_SCR0201_670X370_MB; SEC_TYPE: SM; CHIPS_PART_NAME: C_DIODE_TVS; CDS_PART_NAME: C_DIODE_TVS_SM-J27961-001,EMPTY,ESD203-B1-02ELS,5A,TK2,GENERIC; CDS_LOCATION: CR21151
CR21153 = C_DIODE_TVS: CDS_PHYS_PART_NAME: C_DIODE_TVS_SM-J27961-001,EMPTY,ESD203-B1-02ELS,5A,TK2,GENERIC; CDS_LMAN_SYM_OUTLINE: -100,50,100,-50; FP_TECH: TK2; IP: GENERIC; PACK_TYPE: SM; ROOM: NONE; OriginalSymbolOrigin: (-125,50); XY: (8000,450); VER: 1; ROT: 3; PHYS_PAGE: 112; LOCATION: CR21153; DRAWING: @RVP1_ADL_SB_ADP_S_DDR5_SODIMM_2DPC_LIB.H55_DG2_2DPC(SCH_1):PAGE483; CDS_LIB: local; VARIANT: ?; PCB Footprint: CTK2_SCR0201_670X370_MB; SEC_TYPE: SM; CHIPS_PART_NAME: C_DIODE_TVS; CDS_PART_NAME: C_DIODE_TVS_SM-J27961-001,EMPTY,ESD203-B1-02ELS,5A,TK2,GENERIC; CDS_LOCATION: CR21153
CR21154 = C_DIODE_TVS: CDS_PHYS_PART_NAME: C_DIODE_TVS_SM-J27961-001,EMPTY,ESD203-B1-02ELS,5A,TK2,GENERIC; CDS_LMAN_SYM_OUTLINE: -100,50,100,-50; FP_TECH: TK2; IP: GENERIC; PACK_TYPE: SM; ROOM: NONE; OriginalSymbolOrigin: (-125,50); XY: (8375,1550); VER: 1; ROT: 3; PHYS_PAGE: 112; LOCATION: CR21154; DRAWING: @RVP1_ADL_SB_ADP_S_DDR5_SODIMM_2DPC_LIB.H55_DG2_2DPC(SCH_1):PAGE483; CDS_LIB: local; VARIANT: ?; PCB Footprint: CTK2_SCR0201_670X370_MB; SEC_TYPE: SM; CHIPS_PART_NAME: C_DIODE_TVS; CDS_PART_NAME: C_DIODE_TVS_SM-J27961-001,EMPTY,ESD203-B1-02ELS,5A,TK2,GENERIC; CDS_LOCATION: CR21154
CR21155 = C_DIODE_TVS: CDS_PHYS_PART_NAME: C_DIODE_TVS_SM-J27961-001,EMPTY,ESD203-B1-02ELS,5A,TK2,GENERIC; CDS_LMAN_SYM_OUTLINE: -100,50,100,-50; FP_TECH: TK2; IP: GENERIC; PACK_TYPE: SM; ROOM: NONE; OriginalSymbolOrigin: (-125,50); XY: (8350,975); VER: 1; ROT: 3; PHYS_PAGE: 112; LOCATION: CR21155; DRAWING: @RVP1_ADL_SB_ADP_S_DDR5_SODIMM_2DPC_LIB.H55_DG2_2DPC(SCH_1):PAGE483; CDS_LIB: local; VARIANT: ?; PCB Footprint: CTK2_SCR0201_670X370_MB; SEC_TYPE: SM; CHIPS_PART_NAME: C_DIODE_TVS; CDS_PART_NAME: C_DIODE_TVS_SM-J27961-001,EMPTY,ESD203-B1-02ELS,5A,TK2,GENERIC; CDS_LOCATION: CR21155
EU21021 = C_ALC1316: CDS_PHYS_PART_NAME: C_ALC1316_LCC-M10025-001,IC,ALC1316,TK1,GENERIC; CDS_LMAN_SYM_OUTLINE: -750,1100,750,-1100; FP_TECH: TK1; IP: GENERIC; PACK_TYPE: LCC; ROOM: NONE; OriginalSymbolOrigin: (-775,1100); XY: (3400,2350); VER: 1; ROT: 0; PHYS_PAGE: 112; LOCATION: EU21021; DRAWING: @RVP1_ADL_SB_ADP_S_DDR5_SODIMM_2DPC_LIB.H55_DG2_2DPC(SCH_1):PAGE483; CDS_LIB: local; VARIANT: ?; PCB Footprint: CTK1_LCC48_S6100_400_DFS4400_MB; SEC_TYPE: LCC; CHIPS_PART_NAME: C_ALC1316; CDS_PART_NAME: C_ALC1316_LCC-M10025-001,IC,ALC1316,TK1,GENERIC; CDS_LOCATION: EU21021
FB21134 = FERRITE_2: CDS_PHYS_PART_NAME: FERRITE_2_0805-K89652-001,FB,1K,25%,1.6A,TK2,GENERIC; BOM_USE: STUFF; CDS_LMAN_SYM_OUTLINE: -50,50,50,-50; FP_TECH: TK2; IP: GENERIC; ROOM: NONE; OriginalSymbolOrigin: (-75,50); XY: (7575,1750); VER: 1; ROT: 0; PHYS_PAGE: 112; LOCATION: FB21134; DRAWING: @RVP1_ADL_SB_ADP_S_DDR5_SODIMM_2DPC_LIB.H55_DG2_2DPC(SCH_1):PAGE483; CDS_LIB: discrete_2; VARIANT: ?; PCB Footprint: TK2_SM0805_2200X1450_MA; CHIPS_PART_NAME: FERRITE_2; CDS_PART_NAME: FERRITE_2_0805-K89652-001,FB,1K,25%,1.6A,TK2,GENERIC; CDS_LOCATION: FB21134
FB21139 = FERRITE_2: CDS_PHYS_PART_NAME: FERRITE_2_0805-K89652-001,FB,1K,25%,1.6A,TK2,GENERIC; BOM_USE: STUFF; CDS_LMAN_SYM_OUTLINE: -50,50,50,-50; FP_TECH: TK2; IP: GENERIC; ROOM: NONE; OriginalSymbolOrigin: (-75,50); XY: (7150,650); VER: 1; ROT: 0; PHYS_PAGE: 112; LOCATION: FB21139; DRAWING: @RVP1_ADL_SB_ADP_S_DDR5_SODIMM_2DPC_LIB.H55_DG2_2DPC(SCH_1):PAGE483; CDS_LIB: discrete_2; VARIANT: ?; PCB Footprint: TK2_SM0805_2200X1450_MA; CHIPS_PART_NAME: FERRITE_2; CDS_PART_NAME: FERRITE_2_0805-K89652-001,FB,1K,25%,1.6A,TK2,GENERIC; CDS_LOCATION: FB21139
FB21143 = FERRITE: CDS_PHYS_PART_NAME: FERRITE_0603-H15756-001,FERRITE,120OHM,25%,3A,LPDB,GENERIC; OriginalSymbolOrigin: (-75,50); XY: (8300,4200); VER: 1; ROT: 0; PHYS_PAGE: 112; LOCATION: FB21143; FP_TECH: LPDB; DRAWING: @RVP1_ADL_SB_ADP_S_DDR5_SODIMM_2DPC_LIB.H55_DG2_2DPC(SCH_1):PAGE483; CDS_LIB: discrete; MATERIAL: FERRITE; PCB Footprint: SFB0603IB; CHIPS_PART_NAME: FERRITE; CDS_PART_NAME: FERRITE_0603-H15756-001,FERRITE,120OHM,25%,3A,LPDB,GENERIC; CDS_LOCATION: FB21143
FB21146 = FERRITE_2: CDS_PHYS_PART_NAME: FERRITE_2_0805-K89652-001,FB,1K,25%,1.6A,TK2,GENERIC; BOM_USE: STUFF; CDS_LMAN_SYM_OUTLINE: -50,50,50,-50; FP_TECH: TK2; IP: GENERIC; ROOM: NONE; OriginalSymbolOrigin: (-75,50); XY: (7800,2650); VER: 1; ROT: 0; PHYS_PAGE: 112; LOCATION: FB21146; DRAWING: @RVP1_ADL_SB_ADP_S_DDR5_SODIMM_2DPC_LIB.H55_DG2_2DPC(SCH_1):PAGE483; CDS_LIB: discrete_2; VARIANT: ?; PCB Footprint: TK2_SM0805_2200X1450_MA; CHIPS_PART_NAME: FERRITE_2; CDS_PART_NAME: FERRITE_2_0805-K89652-001,FB,1K,25%,1.6A,TK2,GENERIC; CDS_LOCATION: FB21146
FB21149 = FERRITE_2: CDS_PHYS_PART_NAME: FERRITE_2_0805-K89652-001,FB,1K,25%,1.6A,TK2,GENERIC; BOM_USE: STUFF; CDS_LMAN_SYM_OUTLINE: -50,50,50,-50; FP_TECH: TK2; IP: GENERIC; ROOM: NONE; OriginalSymbolOrigin: (-75,50); XY: (7675,1200); VER: 1; ROT: 0; PHYS_PAGE: 112; LOCATION: FB21149; DRAWING: @RVP1_ADL_SB_ADP_S_DDR5_SODIMM_2DPC_LIB.H55_DG2_2DPC(SCH_1):PAGE483; CDS_LIB: discrete_2; VARIANT: ?; PCB Footprint: TK2_SM0805_2200X1450_MA; CHIPS_PART_NAME: FERRITE_2; CDS_PART_NAME: FERRITE_2_0805-K89652-001,FB,1K,25%,1.6A,TK2,GENERIC; CDS_LOCATION: FB21149
FB21152 = FERRITE: CDS_PHYS_PART_NAME: FERRITE_0603-H15756-001,FERRITE,120OHM,25%,3A,LPDB,GENERIC; OriginalSymbolOrigin: (-75,50); XY: (6625,4650); VER: 1; ROT: 0; PHYS_PAGE: 112; LOCATION: FB21152; FP_TECH: LPDB; DRAWING: @RVP1_ADL_SB_ADP_S_DDR5_SODIMM_2DPC_LIB.H55_DG2_2DPC(SCH_1):PAGE483; CDS_LIB: discrete; MATERIAL: FERRITE; PCB Footprint: SFB0603IB; CHIPS_PART_NAME: FERRITE; CDS_PART_NAME: FERRITE_0603-H15756-001,FERRITE,120OHM,25%,3A,LPDB,GENERIC; CDS_LOCATION: FB21152
J11301 = C_B2B_1X4_2EM: CDS_PHYS_PART_NAME: C_B2B_1X4_2EM_SM-M41180-001,CON,B2B_1X4_2EM_KOZ,TK0,GENERIC; CDS_LMAN_SYM_OUTLINE: -50,250,50,-250; FP_TECH: TK0; IP: GENERIC; PACK_TYPE: SM; ROOM: NONE; OriginalSymbolOrigin: (-50,250); XY: (1725,800); VER: 1; ROT: 2; PHYS_PAGE: 112; LOCATION: J11301; DRAWING: @RVP1_ADL_SB_ADP_S_DDR5_SODIMM_2DPC_LIB.H55_DG2_2DPC(SCH_1):PAGE483; CDS_LIB: local; VARIANT: ?; PCB Footprint: CTK0_B2B_SPR_1X4_2EM_1000_MA_VR_KOZ; SEC_TYPE: SM; CHIPS_PART_NAME: C_B2B_1X4_2EM; CDS_PART_NAME: C_B2B_1X4_2EM_SM-M41180-001,CON,B2B_1X4_2EM_KOZ,TK0,GENERIC; CDS_LOCATION: J11301
R11201 = RES#1: CHIPS_PART_NAME: RES; CDS_PHYS_PART_NAME: RES_0402-A93549-001,CHIP,0,5%,1/16W,LPDB,GENERIC; WATTAGE: 1/16W; OriginalSymbolOrigin: (-75,25); XY: (2300,4450); VER: 1; PHYS_PAGE: 112; LOCATION: R11201; IP: GENERIC; FP_TECH: LPDB; DRAWING: @RVP1_ADL_SB_ADP_S_DDR5_SODIMM_2DPC_LIB.H55_DG2_2DPC(SCH_1):PAGE483; CDS_LIB: discrete; PCB Footprint: SMR0402IA; ROT: 0; CDS_PART_NAME: RES_0402-A93549-001,CHIP,0,5%,1/16W,LPDB,GENERIC; CDS_LOCATION: R11201; ASI_MODEL: A93549-001
R11202 = RES#1: CHIPS_PART_NAME: RES; CDS_PHYS_PART_NAME: RES_0402-A93549-001,CHIP,0,5%,1/16W,LPDB,GENERIC; WATTAGE: 1/16W; OriginalSymbolOrigin: (-75,25); XY: (4825,3250); VER: 1; PHYS_PAGE: 112; LOCATION: R11202; IP: GENERIC; FP_TECH: LPDB; DRAWING: @RVP1_ADL_SB_ADP_S_DDR5_SODIMM_2DPC_LIB.H55_DG2_2DPC(SCH_1):PAGE483; CDS_LIB: discrete; PCB Footprint: SMR0402IA; ROT: 0; CDS_PART_NAME: RES_0402-A93549-001,CHIP,0,5%,1/16W,LPDB,GENERIC; CDS_LOCATION: R11202; ASI_MODEL: A93549-001
R11206 = RES#1: PART_NUMBER: C48657-027; CHIPS_PART_NAME: RES; CDS_PHYS_PART_NAME: RES_0201-C48657-027,CHIP,0,1%,1/20W,LPDB,GENERIC; TOLERANCE: 1%; WATTAGE: 1/20W; OriginalSymbolOrigin: (-75,25); XY: (1950,2450); VER: 1; PHYS_PAGE: 112; LOCATION: R11206; FP_TECH: LPDB; DRAWING: @RVP1_ADL_SB_ADP_S_DDR5_SODIMM_2DPC_LIB.H55_DG2_2DPC(SCH_1):PAGE483; CDS_LIB: discrete; MATERIAL: CHIP; PCB Footprint: SMR0201IA; ROT: 0; CDS_PART_NAME: RES_0201-C48657-027,CHIP,0,1%,1/20W,LPDB,GENERIC; CDS_LOCATION: R11206
R11209 = RES#1: PART_NUMBER: C48657-027; CHIPS_PART_NAME: RES; CDS_PHYS_PART_NAME: RES_0201-C48657-027,CHIP,0,1%,1/20W,LPDB,GENERIC; TOLERANCE: 1%; WATTAGE: 1/20W; OriginalSymbolOrigin: (-75,25); XY: (1950,2400); VER: 1; PHYS_PAGE: 112; LOCATION: R11209; FP_TECH: LPDB; DRAWING: @RVP1_ADL_SB_ADP_S_DDR5_SODIMM_2DPC_LIB.H55_DG2_2DPC(SCH_1):PAGE483; CDS_LIB: discrete; MATERIAL: CHIP; PCB Footprint: SMR0201IA; ROT: 0; CDS_PART_NAME: RES_0201-C48657-027,CHIP,0,1%,1/20W,LPDB,GENERIC; CDS_LOCATION: R11209
R21063 = RES#1: PART_NUMBER: G58158-001; CHIPS_PART_NAME: RES; CDS_PHYS_PART_NAME: RES_0201-G58158-001,EMPTY,15OHM,1%,1/20W,LPDB,GENERIC; TOLERANCE: 1%; WATTAGE: 1/20W; OriginalSymbolOrigin: (-75,25); XY: (5700,1875); VER: 1; SUB_ROOM: SPKR_CONN; PHYS_PAGE: 112; LOCATION: R21063; IP: GENERIC; FP_TECH: LPDB; DRAWING: @RVP1_ADL_SB_ADP_S_DDR5_SODIMM_2DPC_LIB.H55_DG2_2DPC(SCH_1):PAGE483; CDS_LIB: discrete; PCB Footprint: SMR0201IA; ROT: 1; CDS_PART_NAME: RES_0201-G58158-001,EMPTY,15OHM,1%,1/20W,LPDB,GENERIC; CDS_LOCATION: R21063
R21111 = RES: CDS_PHYS_PART_NAME: RES_0201-C80792-002,EMPTY,10K,5%,1/20W,LPDB,GENERIC; OriginalSymbolOrigin: (-25,75); XY: (2850,675); VER: 2; ROT: 0; PHYS_PAGE: 112; LOCATION: R21111; IP: GENERIC; FP_TECH: LPDB; DRAWING: @RVP1_ADL_SB_ADP_S_DDR5_SODIMM_2DPC_LIB.H55_DG2_2DPC(SCH_1):PAGE483; CDS_LIB: discrete; PCB Footprint: SMR0201IA; CHIPS_PART_NAME: RES; CDS_PART_NAME: RES_0201-C80792-002,EMPTY,10K,5%,1/20W,LPDB,GENERIC; CDS_LOCATION: R21111
R21114 = RES: CDS_PHYS_PART_NAME: RES_0201-C80792-002,CHIP,10K,5%,1/20W,LPDB,GENERIC; OriginalSymbolOrigin: (-25,75); XY: (3225,700); VER: 2; ROT: 0; PHYS_PAGE: 112; LOCATION: R21114; FP_TECH: LPDB; DRAWING: @RVP1_ADL_SB_ADP_S_DDR5_SODIMM_2DPC_LIB.H55_DG2_2DPC(SCH_1):PAGE483; CDS_LIB: discrete; PCB Footprint: SMR0201IA; CHIPS_PART_NAME: RES; CDS_PART_NAME: RES_0201-C80792-002,CHIP,10K,5%,1/20W,LPDB,GENERIC; CDS_LOCATION: R21114
R21116 = RES: CDS_PHYS_PART_NAME: RES_0201-C80792-002,CHIP,10K,5%,1/20W,LPDB,GENERIC; OriginalSymbolOrigin: (-25,75); XY: (3625,750); VER: 2; ROT: 0; PHYS_PAGE: 112; LOCATION: R21116; FP_TECH: LPDB; DRAWING: @RVP1_ADL_SB_ADP_S_DDR5_SODIMM_2DPC_LIB.H55_DG2_2DPC(SCH_1):PAGE483; CDS_LIB: discrete; PCB Footprint: SMR0201IA; CHIPS_PART_NAME: RES; CDS_PART_NAME: RES_0201-C80792-002,CHIP,10K,5%,1/20W,LPDB,GENERIC; CDS_LOCATION: R21116
R21117 = RES: CDS_PHYS_PART_NAME: RES_0201-C48657-030,CHIP,100K,1%,1/20W,LPDB,GENERIC; OriginalSymbolOrigin: (-25,75); XY: (1200,2925); VER: 2; ROT: 0; ROOM: NONE; PHYS_PAGE: 112; LOCATION: R21117; IP: GENERIC; FP_TECH: LPDB; DRAWING: @RVP1_ADL_SB_ADP_S_DDR5_SODIMM_2DPC_LIB.H55_DG2_2DPC(SCH_1):PAGE483; CDS_LMAN_SYM_OUTLINE: -50,50,50,-50; CDS_LIB: discrete; BOM_USE: STUFF; PCB Footprint: SMR0201MC; SEC_TYPE: 0201; CHIPS_PART_NAME: RES; CDS_PART_NAME: RES_0201-C48657-030,CHIP,100K,1%,1/20W,LPDB,GENERIC; CDS_LOCATION: R21117
R21119 = RES#1: CHIPS_PART_NAME: RES; CDS_PHYS_PART_NAME: RES_0805-A93556-001,CHIP,10,1%,1/8W,LPDB,GENERIC; WATTAGE: 1/8W; OriginalSymbolOrigin: (-75,25); XY: (4500,4625); VER: 1; ROT: 0; PHYS_PAGE: 112; LOCATION: R21119; FP_TECH: LPDB; DRAWING: @RVP1_ADL_SB_ADP_S_DDR5_SODIMM_2DPC_LIB.H55_DG2_2DPC(SCH_1):PAGE483; CDS_LIB: discrete; PCB Footprint: SMR0805IA; CDS_PART_NAME: RES_0805-A93556-001,CHIP,10,1%,1/8W,LPDB,GENERIC; CDS_LOCATION: R21119
R21123 = RES#1: PART_NUMBER: G58158-001; CHIPS_PART_NAME: RES; CDS_PHYS_PART_NAME: RES_0201-G58158-001,EMPTY,15OHM,1%,1/20W,LPDB,GENERIC; TOLERANCE: 1%; WATTAGE: 1/20W; OriginalSymbolOrigin: (-75,25); XY: (5450,1850); VER: 1; PHYS_PAGE: 112; LOCATION: R21123; IP: GENERIC; FP_TECH: LPDB; DRAWING: @RVP1_ADL_SB_ADP_S_DDR5_SODIMM_2DPC_LIB.H55_DG2_2DPC(SCH_1):PAGE483; CDS_LIB: discrete; PCB Footprint: SMR0201IA; ROT: 1; CDS_PART_NAME: RES_0201-G58158-001,EMPTY,15OHM,1%,1/20W,LPDB,GENERIC; CDS_LOCATION: R21123
R21125 = RES#1: PART_NUMBER: G58158-001; CHIPS_PART_NAME: RES; CDS_PHYS_PART_NAME: RES_0201-G58158-001,EMPTY,15OHM,1%,1/20W,LPDB,GENERIC; TOLERANCE: 1%; WATTAGE: 1/20W; OriginalSymbolOrigin: (-75,25); XY: (5175,1850); VER: 1; PHYS_PAGE: 112; LOCATION: R21125; IP: GENERIC; FP_TECH: LPDB; DRAWING: @RVP1_ADL_SB_ADP_S_DDR5_SODIMM_2DPC_LIB.H55_DG2_2DPC(SCH_1):PAGE483; CDS_LIB: discrete; PCB Footprint: SMR0201IA; ROT: 1; CDS_PART_NAME: RES_0201-G58158-001,EMPTY,15OHM,1%,1/20W,LPDB,GENERIC; CDS_LOCATION: R21125
R21127 = RES#1: CHIPS_PART_NAME: RES; CDS_PHYS_PART_NAME: RES_0201-G58158-001,EMPTY,15OHM,1%,1/20W,LPDB,GENERIC; TOLERANCE: 1%; WATTAGE: 1/20W; OriginalSymbolOrigin: (-75,25); XY: (4925,1850); VER: 1; PHYS_PAGE: 112; LOCATION: R21127; IP: GENERIC; FP_TECH: LPDB; DRAWING: @RVP1_ADL_SB_ADP_S_DDR5_SODIMM_2DPC_LIB.H55_DG2_2DPC(SCH_1):PAGE483; CDS_LIB: discrete; PCB Footprint: SMR0201IA; ROT: 1; CDS_PART_NAME: RES_0201-G58158-001,EMPTY,15OHM,1%,1/20W,LPDB,GENERIC; CDS_LOCATION: R21127
R21140 = RES#1: CHIPS_PART_NAME: RES; CDS_PHYS_PART_NAME: RES_0603-C49684-008,CHIP,0.2,1%,1/10W,LPDB,GENERIC; OriginalSymbolOrigin: (-75,25); XY: (7050,2650); VER: 1; ROT: 0; PHYS_PAGE: 112; LOCATION: R21140; FP_TECH: LPDB; DRAWING: @RVP1_ADL_SB_ADP_S_DDR5_SODIMM_2DPC_LIB.H55_DG2_2DPC(SCH_1):PAGE483; CDS_LIB: discrete; PCB Footprint: SMR0603A; CDS_PART_NAME: RES_0603-C49684-008,CHIP,0.2,1%,1/10W,LPDB,GENERIC; CDS_LOCATION: R21140
R21144 = RES#1: CHIPS_PART_NAME: RES; CDS_PHYS_PART_NAME: RES_0603-C49684-008,CHIP,0.2,1%,1/10W,LPDB,GENERIC; OriginalSymbolOrigin: (-75,25); XY: (6975,1200); VER: 1; ROT: 0; PHYS_PAGE: 112; LOCATION: R21144; FP_TECH: LPDB; DRAWING: @RVP1_ADL_SB_ADP_S_DDR5_SODIMM_2DPC_LIB.H55_DG2_2DPC(SCH_1):PAGE483; CDS_LIB: discrete; PCB Footprint: SMR0603A; CDS_PART_NAME: RES_0603-C49684-008,CHIP,0.2,1%,1/10W,LPDB,GENERIC; CDS_LOCATION: R21144
TP21109 = TP#2: PART_NUMBER: NA_TPS16; CDS_PHYS_PART_NAME: TP_SM-NA_TPS16,EMPTY,TPS16,LPDB,GENERIC; CDS_LMAN_SYM_OUTLINE: -50,50,50,-50; PACK_TYPE: SM; OriginalSymbolOrigin: (-75,50); XY: (1150,1825); VER: 1; ROT: 2; ROOM: NONE; PHYS_PAGE: 112; LOCATION: TP21109; IP: GENERIC; FP_TECH: LPDB; DRAWING: @RVP1_ADL_SB_ADP_S_DDR5_SODIMM_2DPC_LIB.H55_DG2_2DPC(SCH_1):PAGE483; CDS_LIB: board_artifacts; PCB Footprint: TPS16; CHIPS_PART_NAME: TP; CDS_PART_NAME: TP_SM-NA_TPS16,EMPTY,TPS16,LPDB,GENERIC; CDS_LOCATION: TP21109; BOM_USE: EMPTY
TP21112 = TP#2: PART_NUMBER: NA_TPS16; CDS_PHYS_PART_NAME: TP_SM-NA_TPS16,EMPTY,TPS16,LPDB,GENERIC; CDS_LMAN_SYM_OUTLINE: -50,50,50,-50; PACK_TYPE: SM; OriginalSymbolOrigin: (-75,50); XY: (1150,1925); VER: 1; ROT: 2; ROOM: NONE; PHYS_PAGE: 112; LOCATION: TP21112; IP: GENERIC; FP_TECH: LPDB; DRAWING: @RVP1_ADL_SB_ADP_S_DDR5_SODIMM_2DPC_LIB.H55_DG2_2DPC(SCH_1):PAGE483; CDS_LIB: board_artifacts; PCB Footprint: TPS16; CHIPS_PART_NAME: TP; CDS_PART_NAME: TP_SM-NA_TPS16,EMPTY,TPS16,LPDB,GENERIC; CDS_LOCATION: TP21112; BOM_USE: EMPTY
TP21113 = TP#2: PART_NUMBER: NA_TPS16; CDS_PHYS_PART_NAME: TP_SM-NA_TPS16,EMPTY,TPS16,LPDB,GENERIC; CDS_LMAN_SYM_OUTLINE: -150,100,100,-100; PACK_TYPE: SM; OriginalSymbolOrigin: (-75,50); XY: (1150,2025); VER: 1; ROT: 2; ROOM: NONE; PHYS_PAGE: 112; LOCATION: TP21113; IP: GENERIC; FP_TECH: LPDB; DRAWING: @RVP1_ADL_SB_ADP_S_DDR5_SODIMM_2DPC_LIB.H55_DG2_2DPC(SCH_1):PAGE483; CDS_LIB: board_artifacts; PCB Footprint: TPS16; CHIPS_PART_NAME: TP; CDS_PART_NAME: TP_SM-NA_TPS16,EMPTY,TPS16,LPDB,GENERIC; CDS_LOCATION: TP21113; BOM_USE: EMPTY
TP21114 = TP#2: PART_NUMBER: NA_TPS16; CDS_PHYS_PART_NAME: TP_SM-NA_TPS16,EMPTY,TPS16,LPDB,GENERIC; CDS_LMAN_SYM_OUTLINE: -150,100,100,-100; PACK_TYPE: SM; OriginalSymbolOrigin: (-75,50); XY: (1150,2325); VER: 1; ROT: 2; ROOM: NONE; PHYS_PAGE: 112; LOCATION: TP21114; IP: GENERIC; FP_TECH: LPDB; DRAWING: @RVP1_ADL_SB_ADP_S_DDR5_SODIMM_2DPC_LIB.H55_DG2_2DPC(SCH_1):PAGE483; CDS_LIB: board_artifacts; PCB Footprint: TPS16; CHIPS_PART_NAME: TP; CDS_PART_NAME: TP_SM-NA_TPS16,EMPTY,TPS16,LPDB,GENERIC; CDS_LOCATION: TP21114; BOM_USE: EMPTY
TP21115 = TP#2: PART_NUMBER: NA_TPS16; CDS_PHYS_PART_NAME: TP_SM-NA_TPS16,EMPTY,TPS16,LPDB,GENERIC; CDS_LMAN_SYM_OUTLINE: -150,100,100,-100; PACK_TYPE: SM; OriginalSymbolOrigin: (-75,50); XY: (1150,2125); VER: 1; ROT: 2; ROOM: NONE; PHYS_PAGE: 112; LOCATION: TP21115; IP: GENERIC; FP_TECH: LPDB; DRAWING: @RVP1_ADL_SB_ADP_S_DDR5_SODIMM_2DPC_LIB.H55_DG2_2DPC(SCH_1):PAGE483; CDS_LIB: board_artifacts; PCB Footprint: TPS16; CHIPS_PART_NAME: TP; CDS_PART_NAME: TP_SM-NA_TPS16,EMPTY,TPS16,LPDB,GENERIC; CDS_LOCATION: TP21115; BOM_USE: EMPTY
TP21116 = TP#2: PART_NUMBER: NA_TPS16; CDS_PHYS_PART_NAME: TP_SM-NA_TPS16,EMPTY,TPS16,LPDB,GENERIC; CDS_LMAN_SYM_OUTLINE: -150,100,100,-100; PACK_TYPE: SM; OriginalSymbolOrigin: (-75,50); XY: (1150,2225); VER: 1; ROT: 2; ROOM: NONE; PHYS_PAGE: 112; LOCATION: TP21116; IP: GENERIC; FP_TECH: LPDB; DRAWING: @RVP1_ADL_SB_ADP_S_DDR5_SODIMM_2DPC_LIB.H55_DG2_2DPC(SCH_1):PAGE483; CDS_LIB: board_artifacts; PCB Footprint: TPS16; CHIPS_PART_NAME: TP; CDS_PART_NAME: TP_SM-NA_TPS16,EMPTY,TPS16,LPDB,GENERIC; CDS_LOCATION: TP21116; BOM_USE: EMPTY
TP21117 = TP#2: PART_NUMBER: NA_TPS16; CDS_PHYS_PART_NAME: TP_SM-NA_TPS16,EMPTY,TPS16,LPDB,GENERIC; CDS_LMAN_SYM_OUTLINE: -150,100,100,-100; PACK_TYPE: SM; OriginalSymbolOrigin: (-75,50); XY: (4850,2350); VER: 1; ROT: 0; PHYS_PAGE: 112; LOCATION: TP21117; IP: GENERIC; FP_TECH: LPDB; DRAWING: @RVP1_ADL_SB_ADP_S_DDR5_SODIMM_2DPC_LIB.H55_DG2_2DPC(SCH_1):PAGE483; CDS_LIB: board_artifacts; MATERIAL: EMPTY; PCB Footprint: TPS16; CHIPS_PART_NAME: TP; CDS_PART_NAME: TP_SM-NA_TPS16,EMPTY,TPS16,LPDB,GENERIC; CDS_LOCATION: TP21117